# EAGLE board Accumulator Control Unit rev2 (EAGLE 9.6.2)
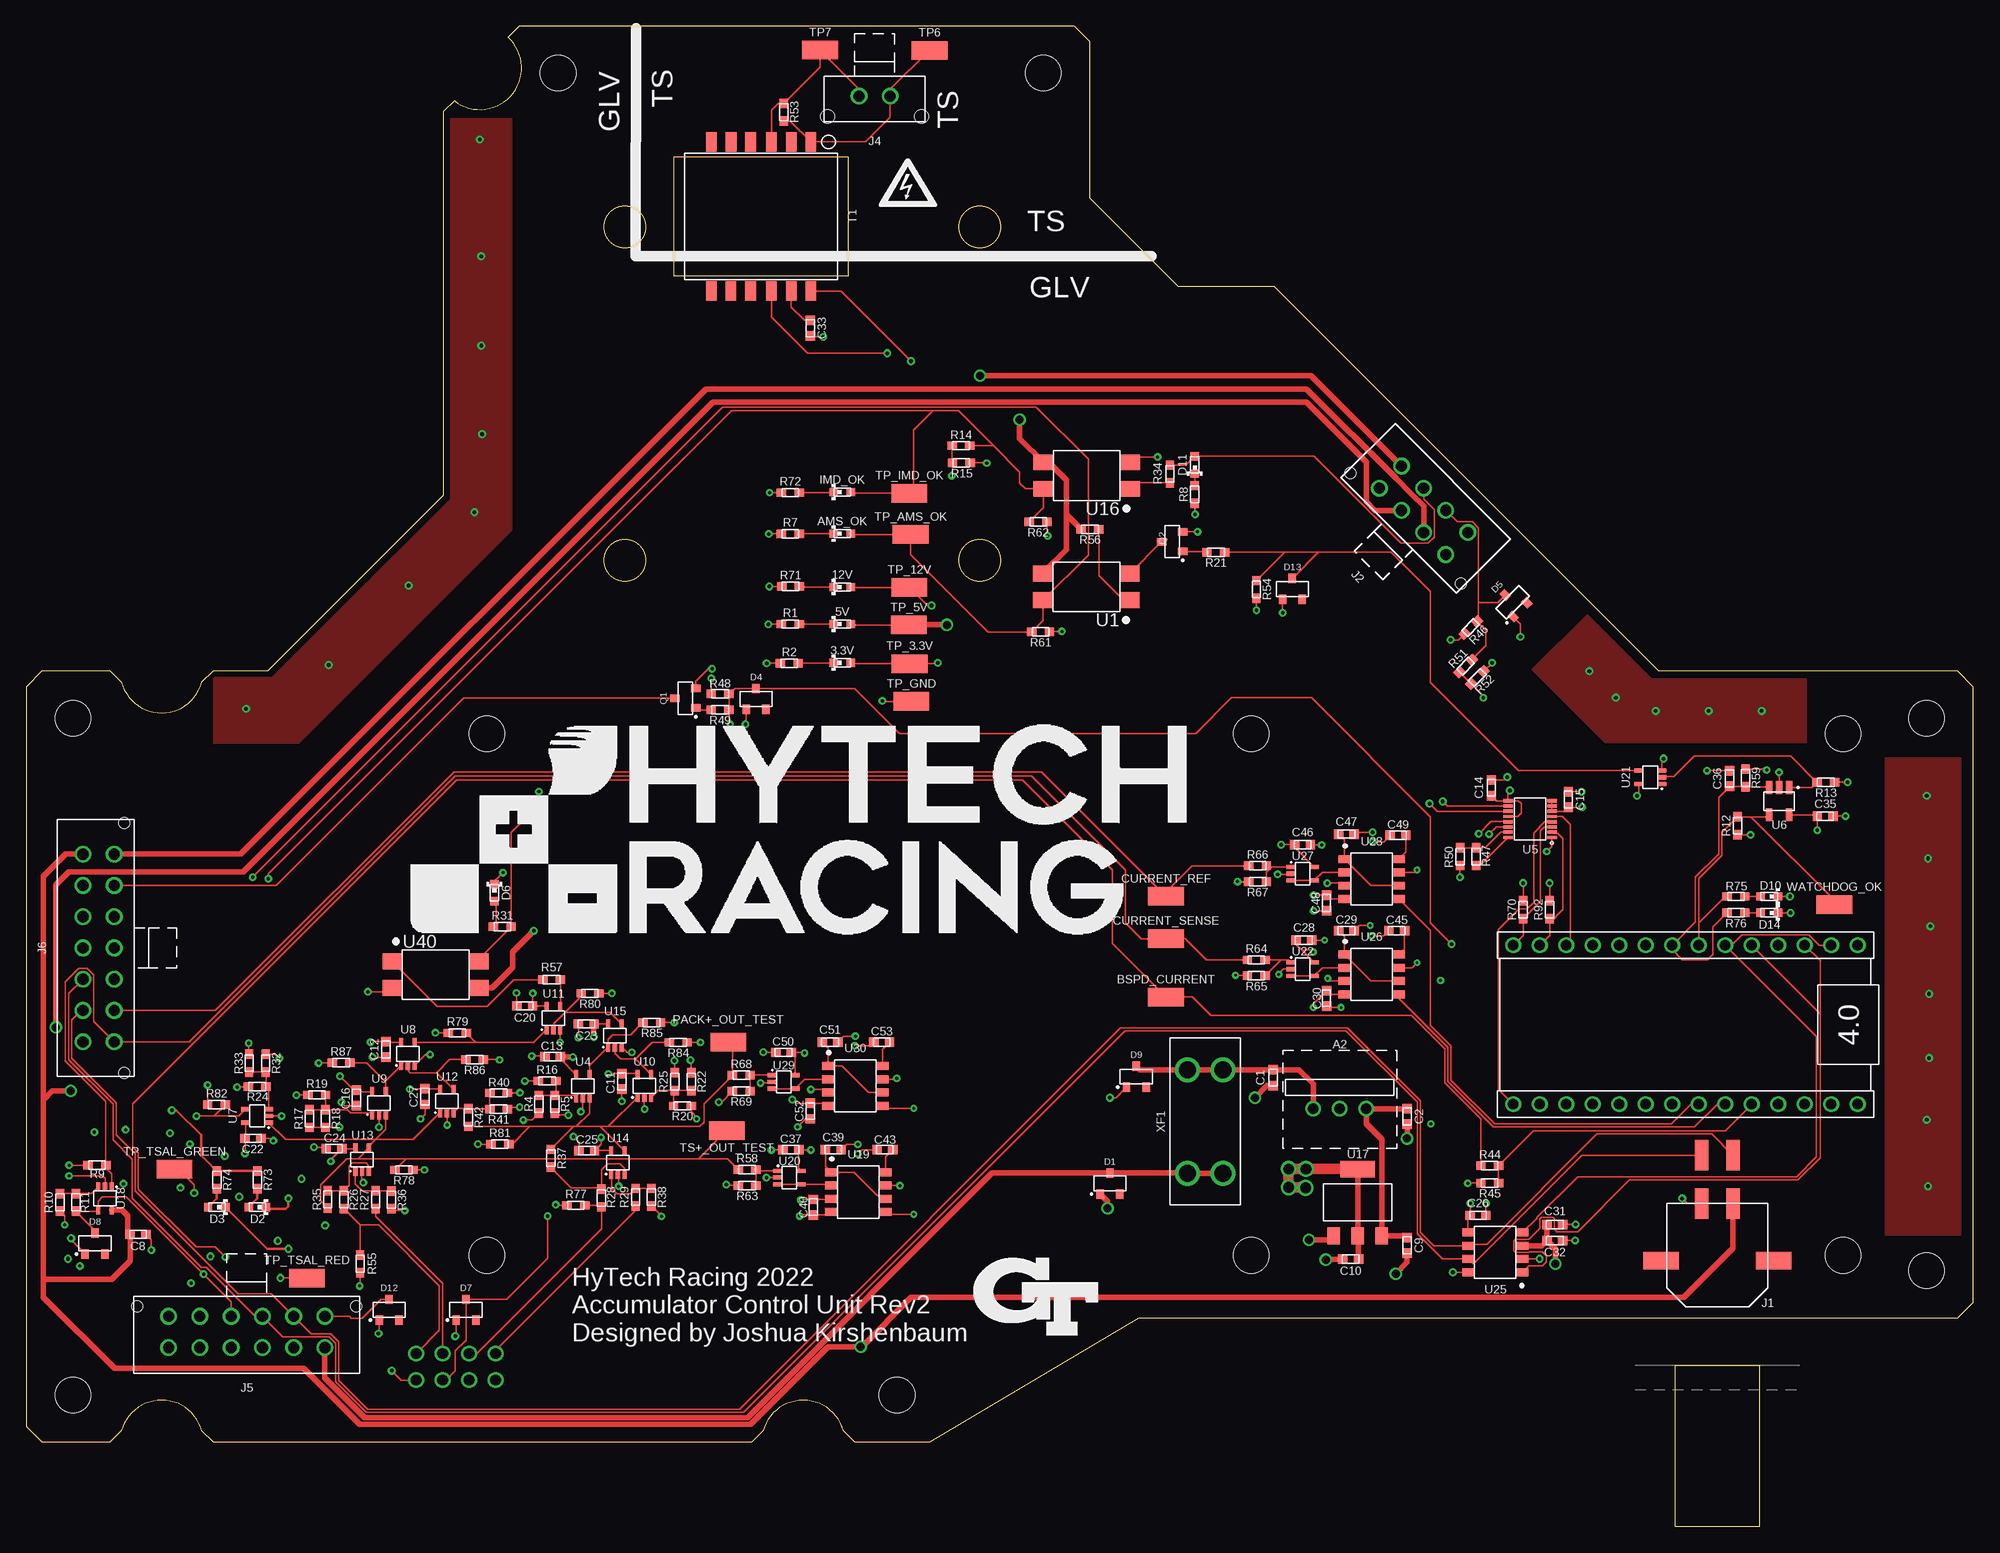
[diagram p6: board, top side]
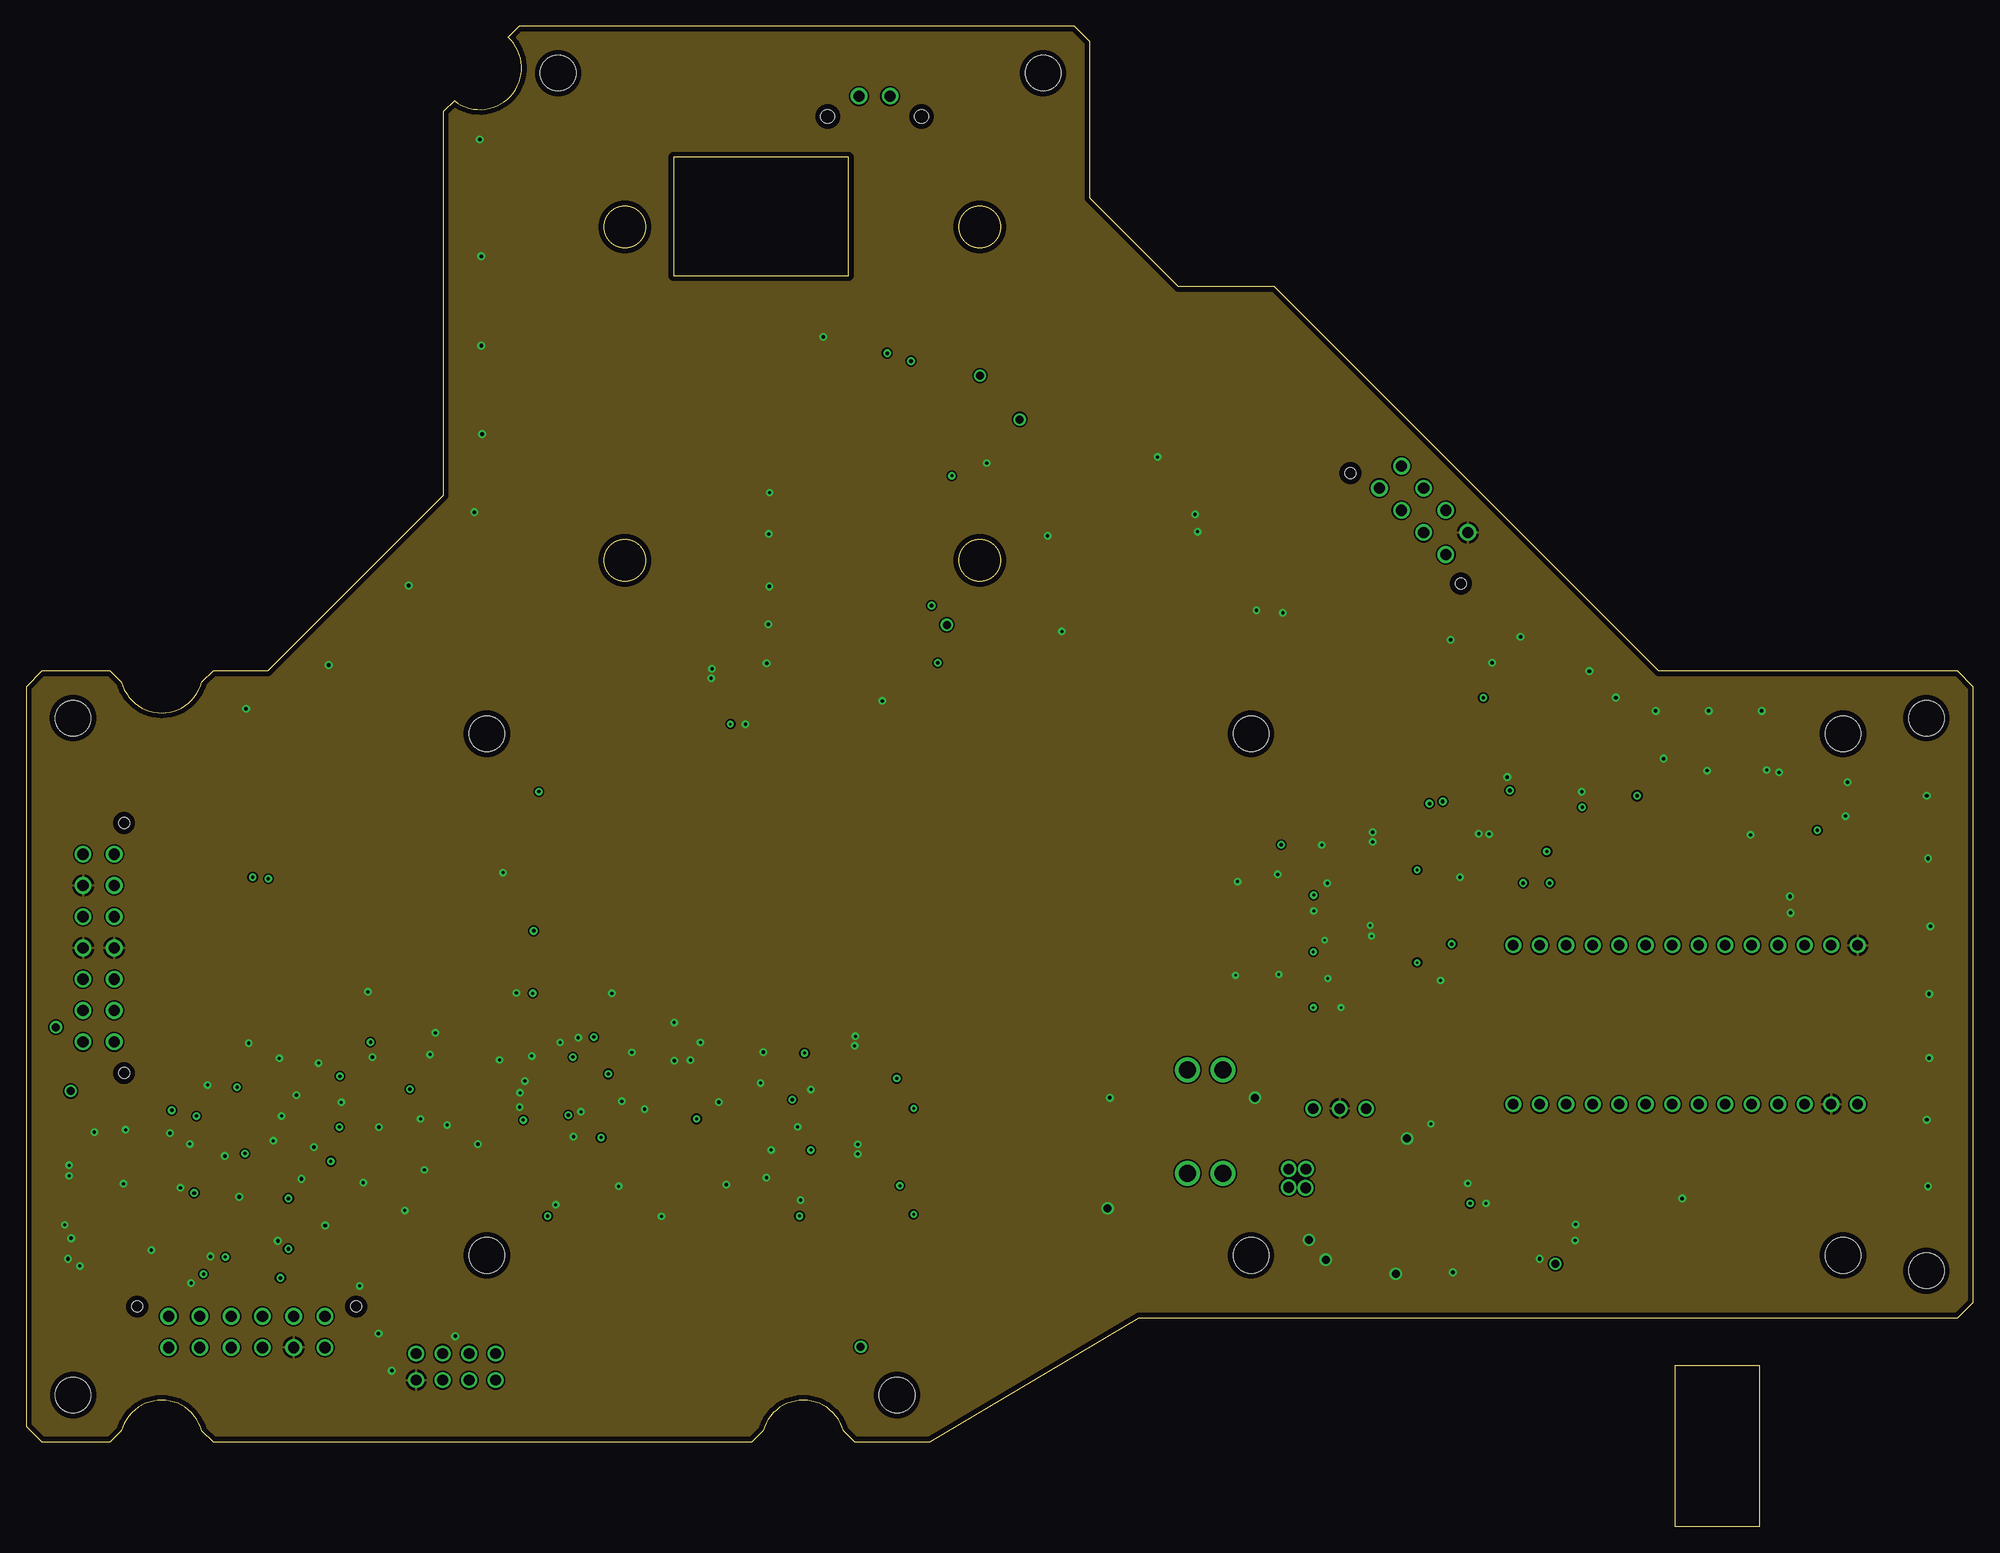
[diagram p7: board, inner layer GND]
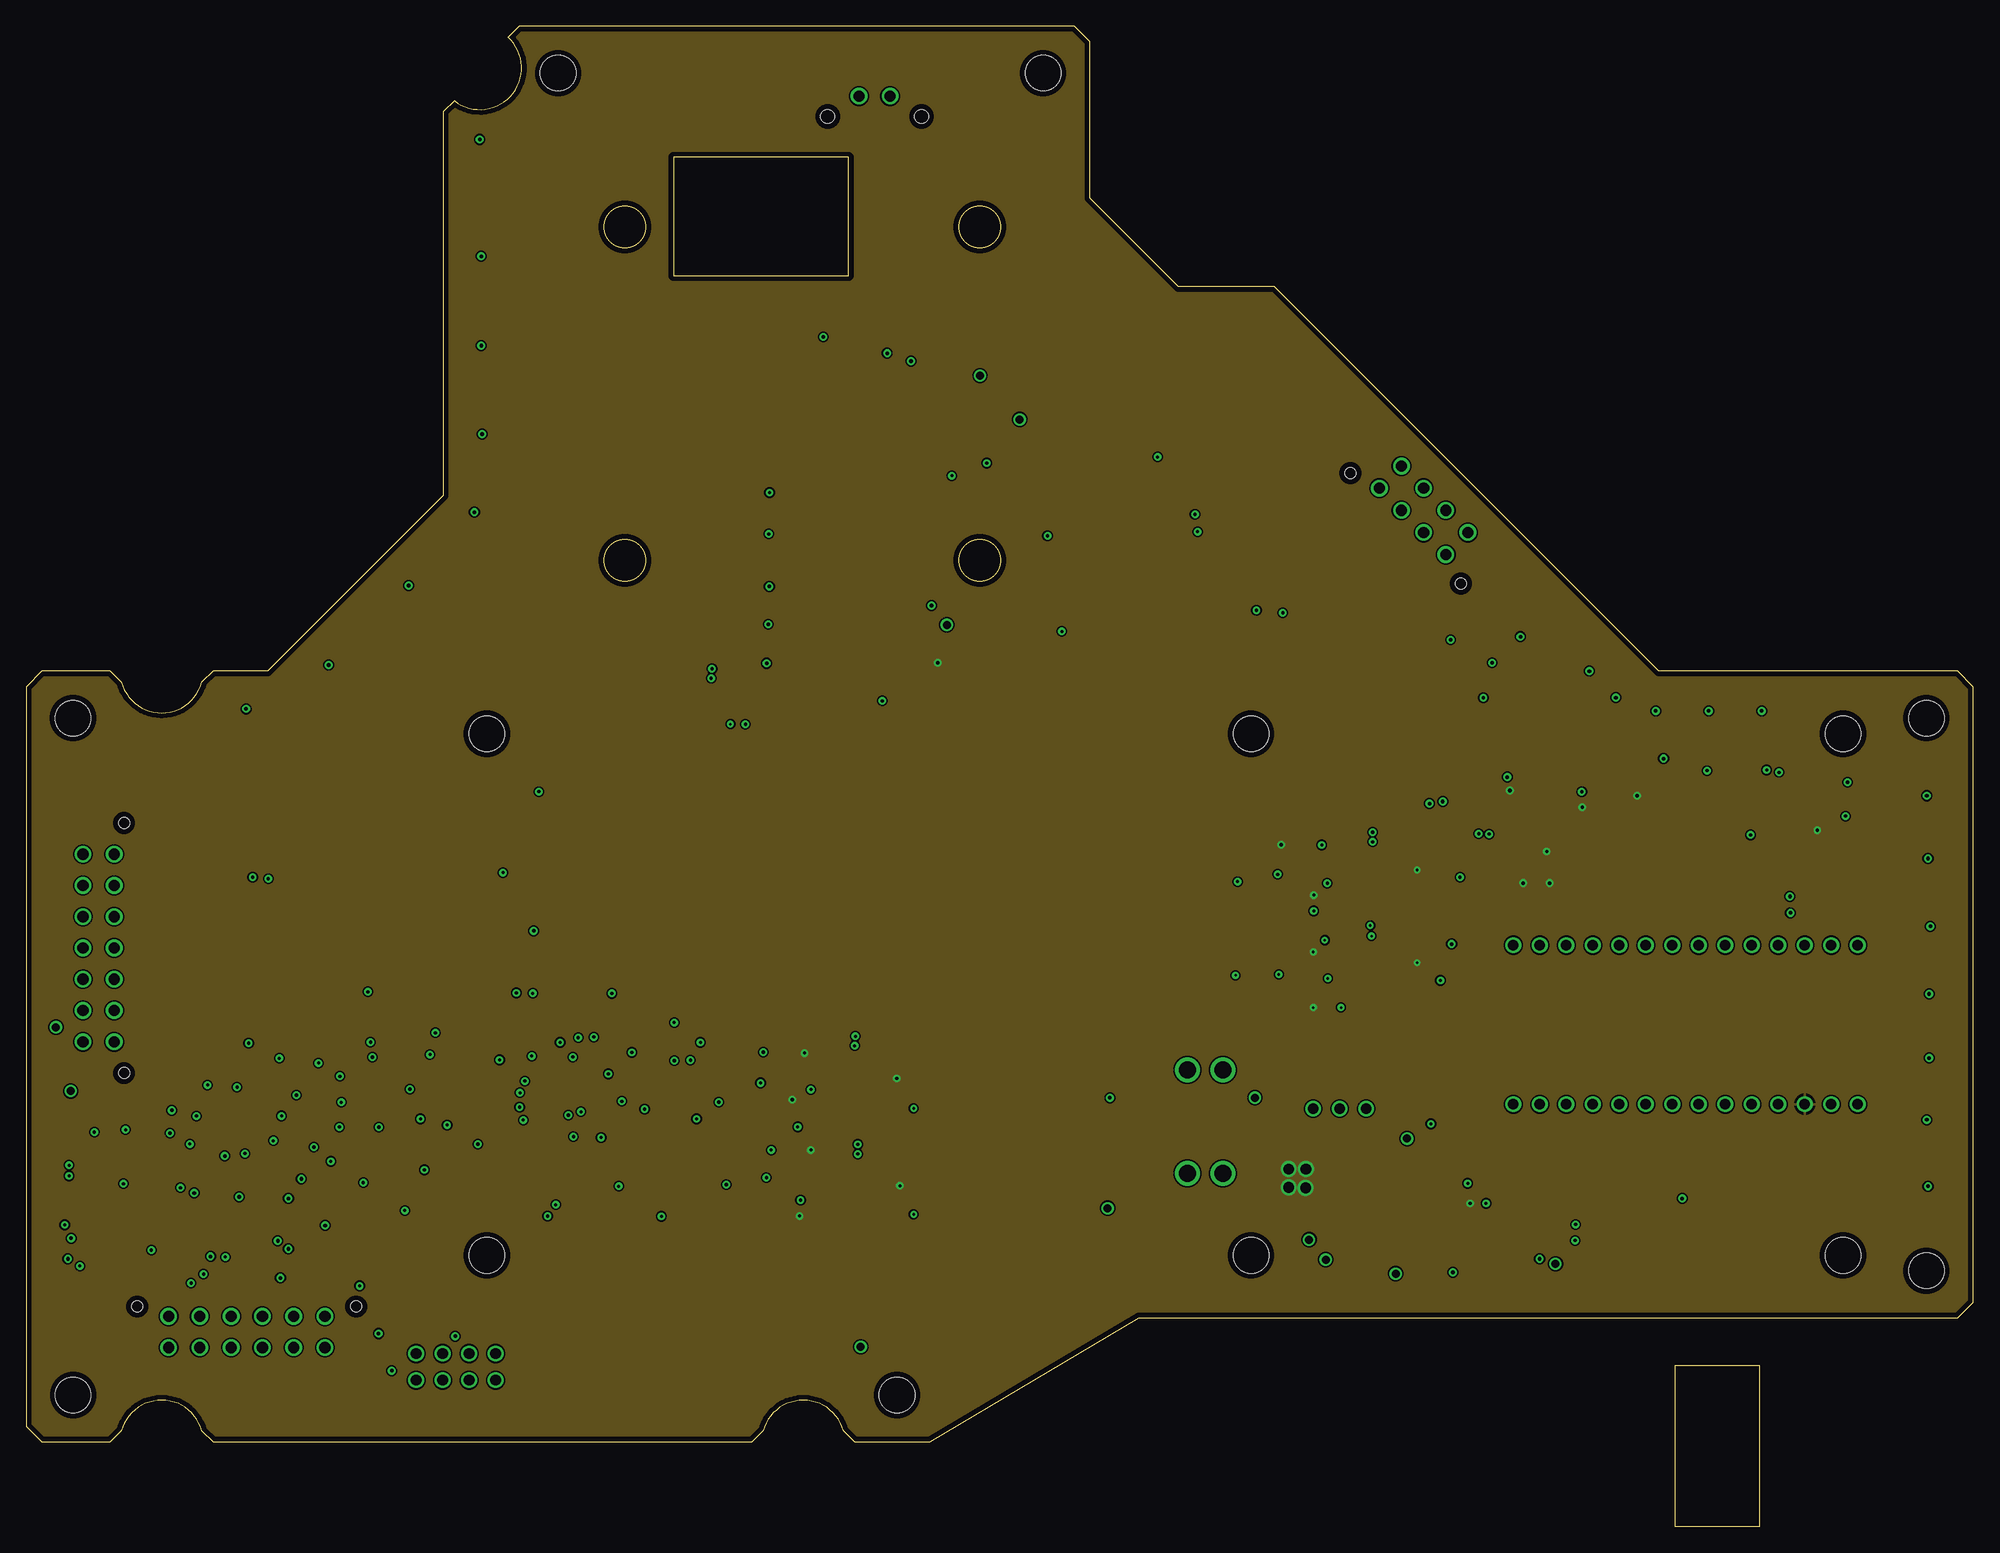
[diagram p8: board, inner layer +3V3]
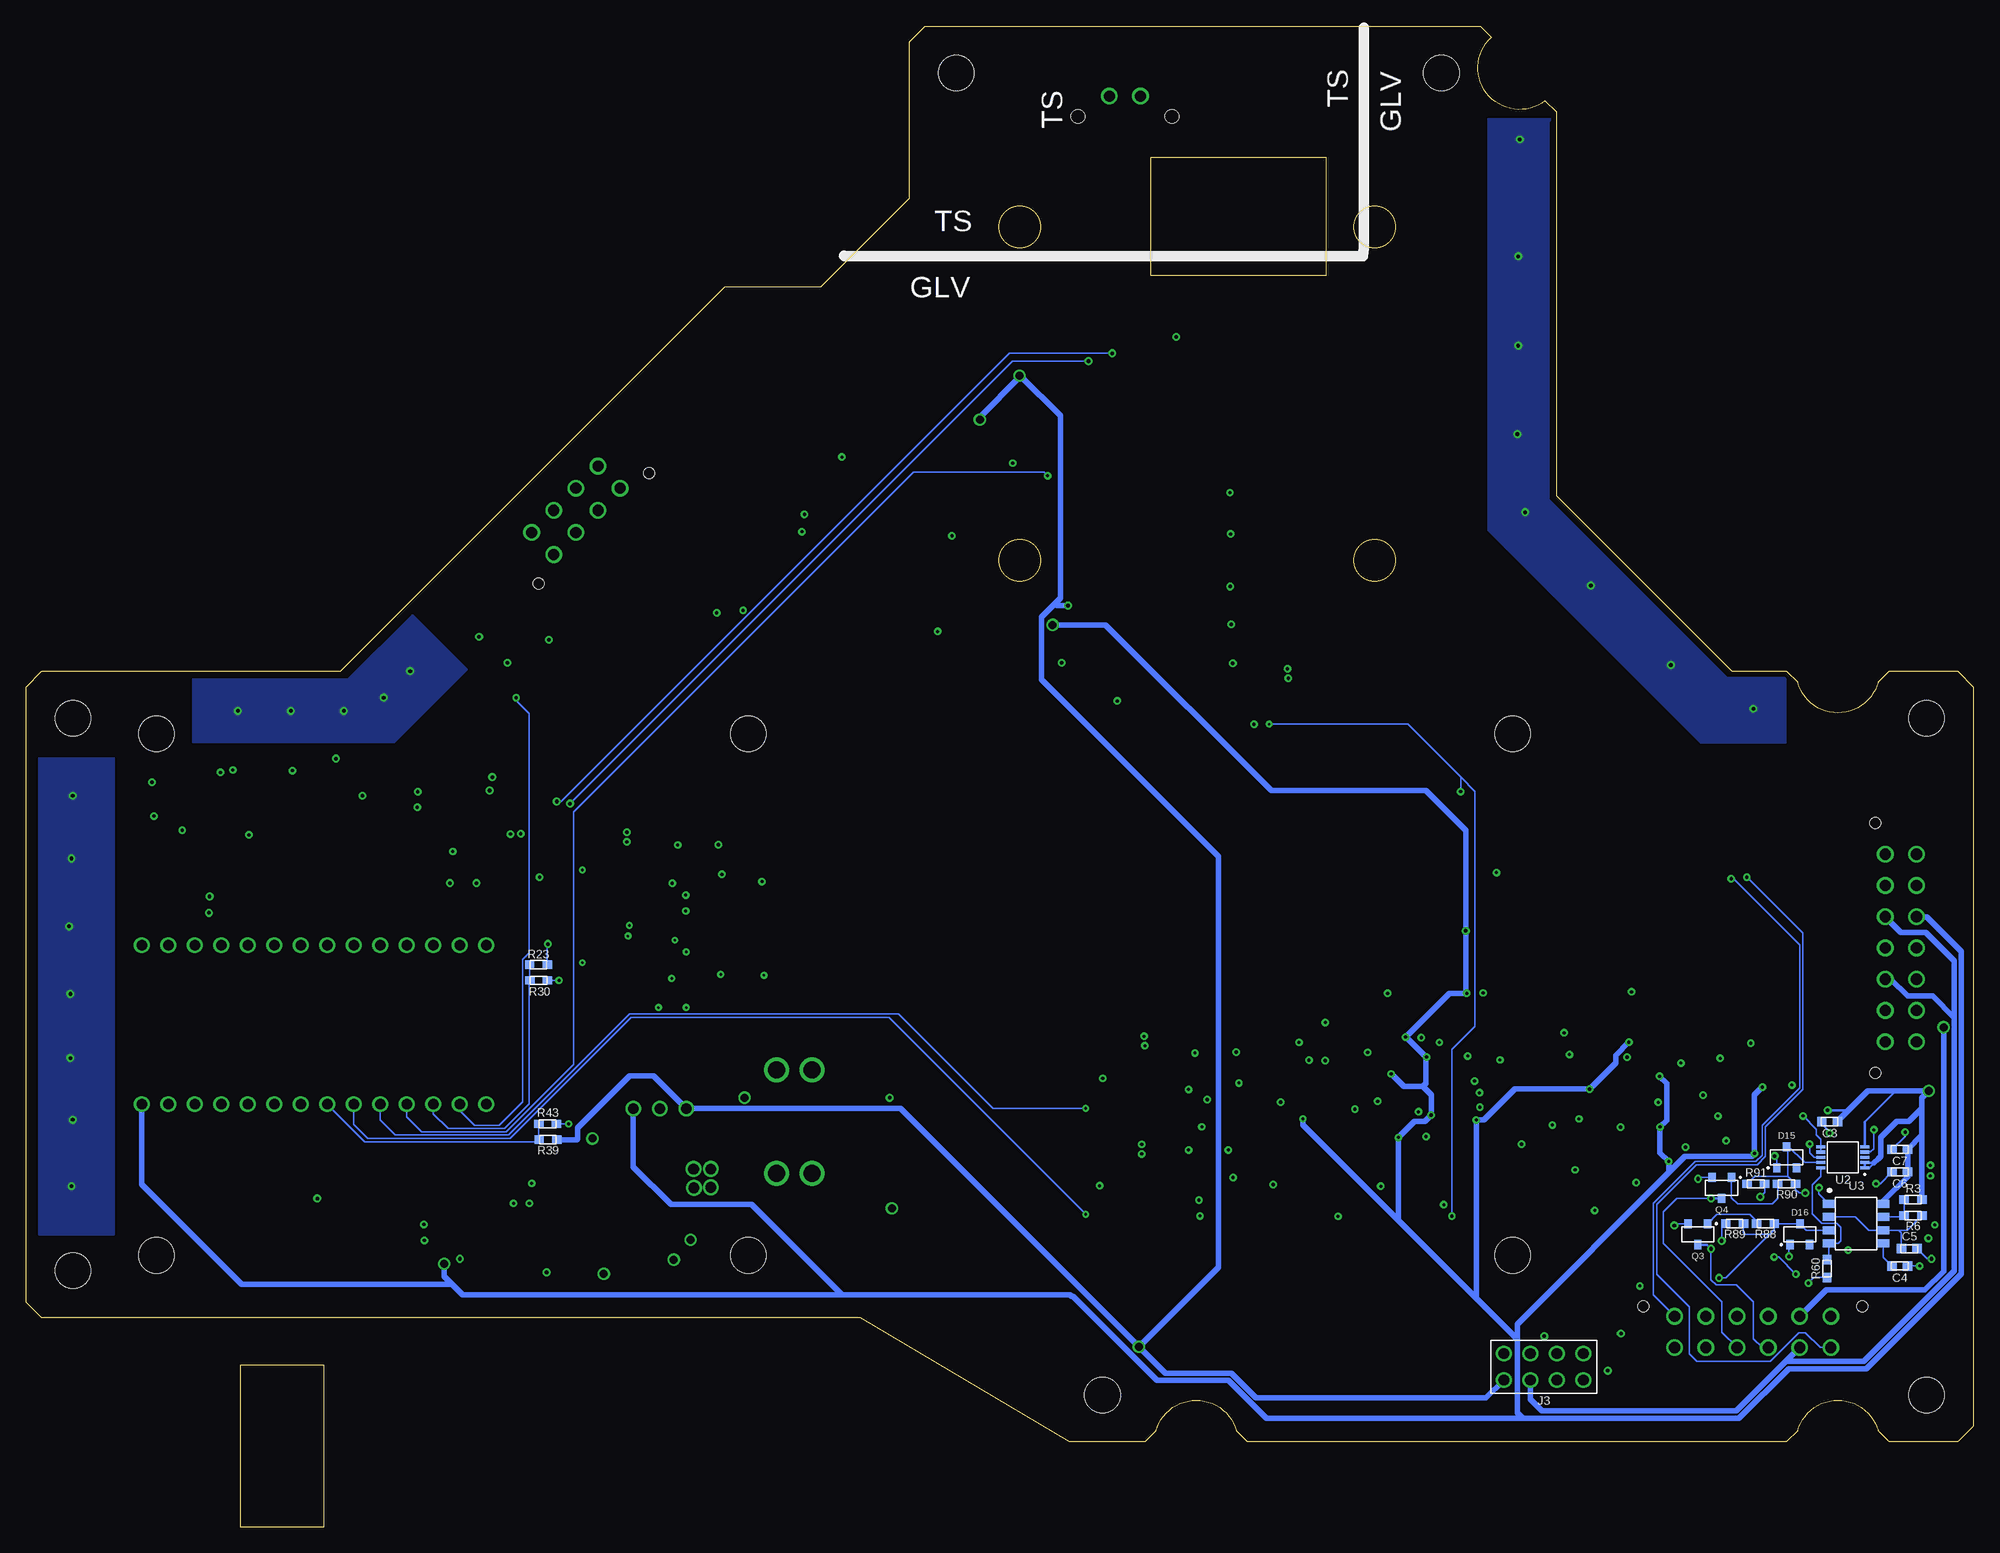
[diagram p9: board, bottom side, seen from below]

Size 186.67 x 135.74 mm. Coordinates in mm from the lower left corner, seen from the top.
Outline: 0,72.39 0,1.5 1.5,0 8.08,0 9.14,1.06 arc-149 16.86,1.06 17.92,0 69.58,0 70.64,1.06 arc-149 78.36,1.06 79.42,0 86.67,0 106.67,11.89 185.17,11.89 186.67,13.39 186.67,72.39 185.17,73.89 156.52,73.89 119.67,110.74 110.48,110.74 102,119.22 102,134.24 100.5,135.74 47.27,135.74 46.21,134.68 arc-175 41.06,128.57 40,127.5 40,90.74 23.15,73.89 17.92,73.89 16.86,72.83 arc-149 9.14,72.83 8.08,73.89 1.5,73.89 0,72.39
Outline: circle at 91.42,116.49 radius 2
Outline: circle at 57.4,84.51 radius 2
Outline: circle at 91.42,84.53 radius 2
Outline: circle at 57.4,116.49 radius 2
Copper layers (1+2*15+16): Top 0.035mm / dielectric 0.2mm / GND 0.0175mm / dielectric 1.065mm / +3V3 0.0175mm / dielectric 0.2mm / Bottom 0.035mm
Design rules "HyTech Default (4 Layer)": minimum track width 6mil, minimum drill 10mil, track to track 6mil, track to pad 6mil, pad to pad 6mil, via to via 20mil, smd to smd 6mil, copper to edge 20mil, drill to drill 21mil, minimum pad ring 8mil, minimum via ring 8mil, stop-mask expansion 3mil, vias tented up to drill 30mil, thermal gap 10mil

## Footprints (pad centres in the part's own frame; a part is rotated, then mirrored left to right if it is on the bottom)
0603-LED = smd 0.8 x 0.8: 1 -0.825,0; 2 0.825,0
TEENSY_SHORT = drill 1.016: 3.3V 0,5.08; AGND/GND 0,2.54; D0 15.24,2.54; D1 15.24,5.08; D2 15.24,7.62; D3 15.24,10.16; D4 15.24,12.7; D5 15.24,15.24; D6 15.24,17.78; D7 15.24,20.32; D8 15.24,22.86; D9 15.24,25.4; D10 15.24,27.94; D11 15.24,30.48; D12 15.24,33.02; D13 0,33.02; D14 0,30.48; D15 0,27.94; D16 0,25.4; D17 0,22.86; D18 0,20.32; D19 0,17.78; D20 0,15.24; D21 0,12.7; D22 0,10.16; D23 0,7.62; GND 15.24,0; VIN 0,0
OKI-78SR = drill 0.991: 1 -2.54,0; 2 0,0; 3 2.54,0
MICRO_MINIATURE = smd 3.429 x 1.778: 1 0,0
0603-CAP = smd 0.9 x 0.9: 1 -0.75,0; 2 0.75,0
SOT-23 = smd 0.711 x 0.889: 1 -0.94,-1.003; 2 0.94,-1.003; 3 0,1.003
MOLEX_MICROFIT_SMD_RIGHTANGLE_04_DUAL = smd 1.27 x 2.921: 1 1.5,5.474; 2 -1.5,5.474; 3 1.5,10.097; 4 -1.5,10.097 | smd 3.429 x 1.651: PAD1 5.386,0; PAD2 -5.386,0
MOLEX_MICROFIT_PTH_VERTICAL_08_DUAL = drill 1.067: 1 4.496,-2.997; 2 1.499,-2.997; 3 -1.499,-2.997; 4 -4.496,-2.997; 5 4.496,0; 6 1.499,0; 7 -1.499,0; 8 -4.496,0 | hole 1.067: 7.493,0.94; -7.493,0.94
FLEX_STACK_PTH_08_DUAL = drill 1.016: 1 -3.81,1.27; 2 -1.27,1.27; 3 1.27,1.27; 4 3.81,1.27; 5 -3.81,-1.27; 6 -1.27,-1.27; 7 1.27,-1.27; 8 3.81,-1.27
MOLEX_MICROFIT_PTH_VERTICAL_02_SINGLE = drill 1.067: 1 1.499,0; 2 -1.499,0 | hole 1.321: 4.496,-1.956; -4.496,-1.956
MOLEX_MICROFIT_PTH_VERTICAL_12_DUAL = drill 1.067: 1 7.493,-2.997; 2 4.496,-2.997; 3 1.499,-2.997; 4 -1.499,-2.997; 5 -4.496,-2.997; 6 -7.493,-2.997; 7 7.493,0; 8 4.496,0; 9 1.499,0; 10 -1.499,0; 11 -4.496,0; 12 -7.493,0 | hole 1.067: 10.49,0.94; -10.49,0.94
MOLEX_MICROFIT_PTH_VERTICAL_14_DUAL = drill 1.067: 1 8.992,-2.997; 2 5.994,-2.997; 3 2.997,-2.997; 4 0,-2.997; 5 -2.997,-2.997; 6 -5.994,-2.997; 7 -8.992,-2.997; 8 8.992,0; 9 5.994,0; 10 2.997,0; 11 0,0; 12 -2.997,0; 13 -5.994,0; 14 -8.992,0 | hole 1.067: 11.989,0.94; -11.989,0.94
0603-RES = smd 0.9 x 0.8: 1 -0.85,0; 2 0.85,0
HM2112ZNLT_AIRGAP = smd 1.02 x 1.89: 1 -4.78,-7.145; 2 -2.89,-7.145; 3 -1,-7.145; 4 1,-7.145; 5 2.875,-7.145; 6 4.78,-7.145; 7 4.78,7.145; 8 2.89,7.145; 9 1,7.145; 10 -1,7.145; 11 -2.89,7.145; 12 -4.78,7.145
DIP-4 = smd 1.5 x 1.9: 1 -1.27,-4.15; 2 1.27,-4.15; 3 -1.27,4.15; 4 1.27,4.15
MSOP-10 = smd 0.305 x 0.889: 1 -1,-2.106; 2 -0.5,-2.106; 3 0,-2.106; 4 0.5,-2.106; 5 1,-2.106; 6 1,2.106; 7 0.5,2.106; 8 0,2.106; 9 -0.5,2.106; 10 -1,2.106
SOIC-08(NARROW,0.15") = smd 0.762 x 1.143: 1 -1.905,-2.603; 2 -0.635,-2.603; 3 0.635,-2.603; 4 1.905,-2.603; 5 1.905,2.603; 6 0.635,2.603; 7 -0.635,2.603; 8 -1.905,2.603
SC-70-5 = smd 0.4 x 0.9: 1 -0.65,-1.1; 2 0,-1.1; 3 0.65,-1.1; 4 0.65,1.1; 5 -0.65,1.1
MSOP-16 = smd 0.305 x 0.889: 1 -1.75,-2.106; 2 -1.25,-2.106; 3 -0.75,-2.106; 4 -0.25,-2.106; 5 0.25,-2.106; 6 0.75,-2.106; 7 1.25,-2.106; 8 1.75,-2.106; 9 1.75,2.106; 10 1.25,2.106; 11 0.75,2.106; 12 0.25,2.106; 13 -0.25,2.106; 14 -0.75,2.106; 15 -1.25,2.106; 16 -1.75,2.106
SOT-23-5 = smd 0.62 x 1.22: 1 -0.95,-1.31; 2 0,-1.31; 3 0.95,-1.31; 4 0.95,1.31; 5 -0.95,1.31
SOT223 = smd 1.2 x 1.6: 1 -2.3,-3.2; 2 0,-3.2; 3 2.3,-3.2 | smd 3.3 x 1.6: 4 0,3.2
MOUNTING_M3 = hole 3.4: 0,0
3568 = drill 1.6: 1 -4.953,1.702; 2 -4.953,-1.702; 3 4.953,-1.702; 4 4.953,1.702

## Placement (x,y rotation side)
3.3V  LED_0603_GREEN  [0603-LED]  78.23,74.69 0 top
5V  LED_0603_BLUE  [0603-LED]  78.23,78.41 0 top
12V  LED_0603_RED  [0603-LED]  78.23,81.96 0 top
A1  TEENSY_4.0  [TEENSY_SHORT]  175.58,32.38 90 top
A2  VOLTAGE_REGULATOR_MODULE_OKI-78SR_5V  [OKI-78SR]  125.93,31.96 0 top
AMS_OK  LED_0603_GREEN  [0603-LED]  78.23,87.08 0 top
BSPD_CURRENT  TEST_POINT  [MICRO_MINIATURE]  109.28,42.64 0 top
C1  CAPACITOR_0603_25V_10UF  [0603-CAP]  119.56,34.93 270 top
C2  CAPACITOR_0603_25V_10UF  [0603-CAP]  132.4,31.2 270 top
C3  CAPACITOR_0603_25V_1UF  [0603-CAP]  13.79,30.72 180 bottom
C4  CAPACITOR_0603_10V_10NF  [0603-CAP]  7.06,16.88 0 bottom
C5  CAPACITOR_0603_10V_4.7UF  [0603-CAP]  6.15,18.52 0 bottom
C6  CAPACITOR_0603_25V_1UF  [0603-CAP]  7.06,25.89 180 bottom
C7  CAPACITOR_0603_25V_0.1UF  [0603-CAP]  7.06,28.05 180 bottom
C8  CAPACITOR_0603_25V_0.1UF  [0603-CAP]  10.72,19.91 0 top
C9  CAPACITOR_0603_10V_1UF  [0603-CAP]  132.38,18.85 270 top
C10  CAPACITOR_0603_10V_4.7UF  [0603-CAP]  126.97,17.53 180 top
C11  CAPACITOR_0603_10V_0.1UF  [0603-CAP]  57.11,34.56 270 top
C12  CAPACITOR_0603_10V_0.1UF  [0603-CAP]  34.5,37.63 270 top
C13  CAPACITOR_0603_10V_0.1UF  [0603-CAP]  50.48,36.92 180 top
C14  CAPACITOR_0603_10V_0.1UF  [0603-CAP]  140.46,62.71 90 top
C15  CAPACITOR_0603_10V_10NF  [0603-CAP]  147.84,61.59 270 top
C16  CAPACITOR_0603_10V_0.1UF  [0603-CAP]  31.68,32.99 270 top
C20  CAPACITOR_0603_10V_0.1UF  [0603-CAP]  47.81,41.8 180 top
C22  CAPACITOR_0603_10V_0.1UF  [0603-CAP]  21.75,29.1 0 top
C23  CAPACITOR_0603_10V_0.1UF  [0603-CAP]  53.7,40.07 180 top
C24  CAPACITOR_0603_10V_0.1UF  [0603-CAP]  29.52,28.11 180 top
C25  CAPACITOR_0603_10V_0.1UF  [0603-CAP]  53.75,27.93 180 top
C26  CAPACITOR_0603_10V_0.1UF  [0603-CAP]  139.19,21.73 180 top
C27  CAPACITOR_0603_10V_0.1UF  [0603-CAP]  38.23,33.11 270 top
C28  CAPACITOR_0603_25V_0.1UF  [0603-CAP]  122.5,48.12 0 top
C29  CAPACITOR_0603_10V_0.1UF  [0603-CAP]  126.56,49.01 0 top
C30  CAPACITOR_0603_10V_0.1UF  [0603-CAP]  124.66,42.53 270 top
C31  CAPACITOR_0603_10V_0.1UF  [0603-CAP]  146.55,20.84 180 top
C32  CAPACITOR_0603_10V_1UF  [0603-CAP]  146.55,19.31 180 top
C33  CAPACITOR_0603_10V_10NF  [0603-CAP]  75.16,106.77 270 top
C35  CAPACITOR_0603_10V_0.1UF  [0603-CAP]  172.46,59.98 0 top
C36  CAPACITOR_0603_10V_0.1UF  [0603-CAP]  163.31,63.6 90 top
C37  CAPACITOR_0603_25V_0.1UF  [0603-CAP]  73.3,28.02 180 top
C39  CAPACITOR_0603_10V_0.1UF  [0603-CAP]  77.37,28.02 0 top
C40  CAPACITOR_0603_10V_0.1UF  [0603-CAP]  75.46,22.51 90 top
C43  CAPACITOR_0603_10V_680PF  [0603-CAP]  82.32,28.02 180 top
C45  CAPACITOR_0603_10V_680PF  [0603-CAP]  131.39,49.01 180 top
C46  CAPACITOR_0603_25V_0.1UF  [0603-CAP]  122.37,57.26 0 top
C47  CAPACITOR_0603_10V_0.1UF  [0603-CAP]  126.56,58.28 0 top
C48  CAPACITOR_0603_10V_0.1UF  [0603-CAP]  124.66,51.67 270 top
C49  CAPACITOR_0603_10V_680PF  [0603-CAP]  131.52,58.15 180 top
C50  CAPACITOR_0603_25V_0.1UF  [0603-CAP]  72.62,37.34 180 top
C51  CAPACITOR_0603_10V_0.1UF  [0603-CAP]  77.06,38.33 0 top
C52  CAPACITOR_0603_10V_0.1UF  [0603-CAP]  75.16,31.73 270 top
C53  CAPACITOR_0603_10V_680PF  [0603-CAP]  82.02,38.33 180 top
CURRENT_REF  TEST_POINT  [MICRO_MINIATURE]  109.28,52.3 0 top
CURRENT_SENSE  TEST_POINT  [MICRO_MINIATURE]  109.28,48.27 0 top
D1  TVS_15V  [SOT-23]  103.91,24.78 0 top
D2  LED_0603_GREEN  [0603-LED]  22.17,22.51 180 top
D3  LED_0603_RED  [0603-LED]  18.29,22.51 180 top
D4  TVS_8V  [SOT-23]  69.97,71.23 0 top
D5  TVS_15V  [SOT-23]  142.49,80.49 45 top
D6  LED_0603_RED  [0603-LED]  44.9,52.65 270 top
D7  TVS_15V  [SOT-23]  42.16,12.68 0 top
D8  TVS_15V  [SOT-23]  6.6,19.03 0 top
D9  TVS_15V  [SOT-23]  106.43,35.03 0 top
D10  LED_0603_GREEN  [0603-LED]  167.11,52.3 180 top
D11  LED_0603_YELLOW  [0603-LED]  112.04,93.66 90 top
D12  TVS_15V  [SOT-23]  34.8,12.68 0 top
D13  TVS_8V  [SOT-23]  121.39,81.78 0 top
D14  LED_0603_RED  [0603-LED]  167.11,50.73 180 top
D15  TVS_15V  [SOT-23]  17.91,27.28 0 bottom
D16  TVS_15V  [SOT-23]  16.64,19.91 0 bottom
IMD_OK  LED_0603_ORANGE  [0603-LED]  78.23,91.06 0 top
J1  CONNECTOR-CAN_μF_S_RA_  [MOLEX_MICROFIT_SMD_RIGHTANGLE_04_DUAL]  162.12,17.38 0 top
J2  CONNECTOR-8_MF_T_V_  [MOLEX_MICROFIT_PTH_VERTICAL_08_DUAL]  132.91,88.25 135 top
J3  CONNECTOR-8_S_S  [FLEX_STACK_PTH_08_DUAL]  41.2,7.2 0 bottom
J4  CONNECTOR-2_MF_T_V_  [MOLEX_MICROFIT_PTH_VERTICAL_02_SINGLE]  81.34,129.02 0 top
J5  CONNECTOR-12_MF_T_V_  [MOLEX_MICROFIT_PTH_VERTICAL_12_DUAL]  21.15,12.05 0 top
J6  CONNECTOR-14_MF_T_V_  [MOLEX_MICROFIT_PTH_VERTICAL_14_DUAL]  8.45,47.36 270 top
PACK+_OUT_TEST  TEST_POINT  [MICRO_MINIATURE]  67.31,38.33 180 top
Q1  TRANSISTOR_N_MOS__PMV15ENEA  [SOT-23]  63.19,71.31 90 top
Q2  TRANSISTOR_N_MOS__PMV15ENEA  [SOT-23]  109.86,86.31 90 top
Q3  TRANSISTOR_N_MOS__PMV15ENEA  [SOT-23]  26.42,19.91 180 bottom
Q4  TRANSISTOR_N_MOS__PMV15ENEA  [SOT-23]  24.13,24.36 180 bottom
R1  RESISTOR_0603_1K  [0603-RES]  73.25,78.41 0 top
R2  RESISTOR_0603_1K  [0603-RES]  73.15,74.65 0 top
R3  RESISTOR_0603_1K  [0603-RES]  5.79,23.23 0 bottom
R4  RESISTOR_0603_DNP  [0603-RES]  49.15,32.38 270 top
R5  RESISTOR_0603_4.12K  [0603-RES]  50.68,32.38 270 top
R6  RESISTOR_0603_43K  [0603-RES]  5.79,21.7 180 bottom
R7  RESISTOR_0603_1K  [0603-RES]  73.25,87.07 0 top
R8  RESISTOR_0603_1K  [0603-RES]  112.04,90.83 90 top
R9  RESISTOR_0603_10K  [0603-RES]  6.8,26.53 0 top
R10  RESISTOR_0603_1K  [0603-RES]  3.25,22.97 90 top
R11  RESISTOR_0603_1.4K  [0603-RES]  4.77,22.97 270 top
R12  RESISTOR_0603_10K  [0603-RES]  164.05,59.08 90 top
R13  RESISTOR_0603_100K  [0603-RES]  172.52,63.24 180 top
R14  RESISTOR_0603_33K  [0603-RES]  89.62,95.51 180 top
R15  RESISTOR_0603_12K  [0603-RES]  89.65,93.88 0 top
R16  RESISTOR_0603_10.2K  [0603-RES]  49.94,34.61 0 top
R17  RESISTOR_0603_4.12K  [0603-RES]  27.16,31.01 270 top
R18  RESISTOR_0603_DNP  [0603-RES]  28.71,31.01 270 top
R19  RESISTOR_0603_10.2K  [0603-RES]  27.87,33.27 0 top
R20  RESISTOR_0603_11.5K  [0603-RES]  62.92,32.22 0 top
R21  RESISTOR_0603_10  [0603-RES]  114.05,85.3 180 top
R22  RESISTOR_0603_DNP  [0603-RES]  63.76,34.54 270 top
R23  RESISTOR_0603_18.7K  [0603-RES]  137.56,45.76 180 bottom
R24  RESISTOR_0603_84.5K  [0603-RES]  22.15,34.05 180 top
R25  RESISTOR_0603_11.5K  [0603-RES]  62.19,34.54 270 top
R26  RESISTOR_0603_11.5K  [0603-RES]  30.46,23.23 90 top
R27  RESISTOR_0603_11.5K  [0603-RES]  33.51,23.23 90 top
R28  RESISTOR_0603_11.5K  [0603-RES]  55.15,23.39 90 top
R29  RESISTOR_0603_11.5K  [0603-RES]  58.43,23.46 90 top
R30  RESISTOR_0603_33K  [0603-RES]  137.54,44.24 0 bottom
R31  RESISTOR_0603_1K  [0603-RES]  45.65,49.39 0 top
R32  RESISTOR_0603_DNP  [0603-RES]  22.97,36.31 270 top
R33  RESISTOR_0603_11.5K  [0603-RES]  21.39,36.31 270 top
R34  RESISTOR_0603_2K  [0603-RES]  109.65,92.8 270 top
R35  RESISTOR_0603_10.5K  [0603-RES]  28.91,23.26 270 top
R36  RESISTOR_0603_10.5K  [0603-RES]  35.03,23.21 270 top
R37  RESISTOR_0603_10.5K  [0603-RES]  50.3,27.2 90 top
R38  RESISTOR_0603_10.5K  [0603-RES]  59.95,23.46 270 top
R39  RESISTOR_0603_33K  [0603-RES]  136.65,28.97 180 bottom
R40  RESISTOR_0603_DNP  [0603-RES]  45.29,33.47 180 top
R41  RESISTOR_0603_215K  [0603-RES]  45.29,31.92 180 top
R42  RESISTOR_0603_11.3K  [0603-RES]  42.4,31.11 270 top
R43  RESISTOR_0603_12K  [0603-RES]  136.67,30.49 0 bottom
R44  RESISTOR_0603_33K  [0603-RES]  140.3,26.48 0 top
R45  RESISTOR_0603_12K  [0603-RES]  140.3,24.83 180 top
R46  RESISTOR_0603_2.2K  [0603-RES]  138.48,78.07 45 top
R47  RESISTOR_0603_1K  [0603-RES]  139.02,56.12 90 top
R48  RESISTOR_0603_10K  [0603-RES]  66.52,71.74 180 top
R49  RESISTOR_0603_10  [0603-RES]  66.52,70.19 180 top
R50  RESISTOR_0603_1K  [0603-RES]  137.47,56.11 270 top
R51  RESISTOR_0603_33K  [0603-RES]  138,74.39 225 top
R52  RESISTOR_0603_15K  [0603-RES]  139.12,73.29 45 top
R53  RESISTOR_0603_100  [0603-RES]  72.64,127.48 270 top
R54  RESISTOR_0603_10K  [0603-RES]  117.95,81.73 270 top
R55  RESISTOR_0603_10K  [0603-RES]  32.03,17.07 90 top
R56  RESISTOR_0603_2K  [0603-RES]  101.99,87.51 180 top
R57  RESISTOR_0603_470  [0603-RES]  50.37,44.31 180 top
R58  RESISTOR_0603_10K  [0603-RES]  69.11,26.11 0 top
R59  RESISTOR_0603_10K  [0603-RES]  164.83,63.66 270 top
R60  RESISTOR_0603_10K  [0603-RES]  14.04,16.62 90 bottom
R61  RESISTOR_0603_10K  [0603-RES]  97.26,77.66 180 top
R62  RESISTOR_0603_10K  [0603-RES]  97.01,88.2 180 top
R63  RESISTOR_0603_12K  [0603-RES]  69.11,24.59 180 top
R64  RESISTOR_0603_10K  [0603-RES]  117.93,46.21 0 top
R65  RESISTOR_0603_12K  [0603-RES]  117.93,44.69 180 top
R66  RESISTOR_0603_10K  [0603-RES]  118.05,55.23 0 top
R67  RESISTOR_0603_12K  [0603-RES]  118.05,53.71 180 top
R68  RESISTOR_0603_10K  [0603-RES]  68.55,35.16 0 top
R69  RESISTOR_0603_12K  [0603-RES]  68.55,33.63 180 top
R70  RESISTOR_0603_2K  [0603-RES]  143.51,51.03 90 top
R71  RESISTOR_0603_1K  [0603-RES]  73.28,82.02 0 top
R72  RESISTOR_0603_2K  [0603-RES]  73.25,91.01 0 top
R73  RESISTOR_0603_2K  [0603-RES]  22.17,25.12 270 top
R74  RESISTOR_0603_2K  [0603-RES]  18.29,25.12 270 top
R75  RESISTOR_0603_470  [0603-RES]  163.91,52.3 180 top
R76  RESISTOR_0603_470  [0603-RES]  163.91,50.73 180 top
R77  RESISTOR_0603_10K  [0603-RES]  52.7,22.68 0 top
R78  RESISTOR_0603_10K  [0603-RES]  36.22,26.09 180 top
R79  RESISTOR_0603_10K  [0603-RES]  41.35,39.22 0 top
R80  RESISTOR_0603_10K  [0603-RES]  54.05,43 180 top
R81  RESISTOR_0603_10K  [0603-RES]  45.42,28.55 0 top
R82  RESISTOR_0603_10K  [0603-RES]  18.26,32.34 0 top
R84  RESISTOR_0603_10K  [0603-RES]  62.51,38.3 180 top
R85  RESISTOR_0603_10K  [0603-RES]  59.97,40.21 180 top
R86  RESISTOR_0603_10K  [0603-RES]  43,36.65 180 top
R87  RESISTOR_0603_10K  [0603-RES]  30.2,36.35 0 top
R88  RESISTOR_0603_10  [0603-RES]  19.94,20.93 180 bottom
R89  RESISTOR_0603_10K  [0603-RES]  22.89,20.93 180 bottom
R90  RESISTOR_0603_10  [0603-RES]  17.91,24.74 180 bottom
R91  RESISTOR_0603_10K  [0603-RES]  20.85,24.74 0 bottom
R92  RESISTOR_0603_2K  [0603-RES]  146.05,51.03 90 top
T1  TRANSFORMER_HM2112ZNLT_AIRGAP  [HM2112ZNLT_AIRGAP]  70.45,117.49 180 top
TP6  TEST_POINT  [MICRO_MINIATURE]  86.59,133.42 0 top
TP7  TEST_POINT  [MICRO_MINIATURE]  76.1,133.44 0 top
TP_3.3V  TEST_POINT  [MICRO_MINIATURE]  84.68,74.62 0 top
TP_5V  TEST_POINT  [MICRO_MINIATURE]  84.62,78.32 0 top
TP_12V  TEST_POINT  [MICRO_MINIATURE]  84.66,81.93 0 top
TP_AMS_OK  TEST_POINT  [MICRO_MINIATURE]  84.79,87 0 top
TP_GND  TEST_POINT  [MICRO_MINIATURE]  84.85,71 0 top
TP_IMD_OK  TEST_POINT  [MICRO_MINIATURE]  84.66,90.96 0 top
TP_TSAL_GREEN  TEST_POINT  [MICRO_MINIATURE]  14.22,26.14 0 top
TP_TSAL_RED  TEST_POINT  [MICRO_MINIATURE]  26.92,15.72 0 top
TS+_OUT_TEST  TEST_POINT  [MICRO_MINIATURE]  67.16,29.85 180 top
U1  RELAY_SOLIDSTATE_NO  [DIP-4]  101.64,81.98 90 top
U2  ADG1423  [MSOP-10]  12.52,27.29 90 bottom
U3  LM555  [SOIC-08(NARROW,0.15")]  11.25,20.94 270 bottom
U4  OPAMP_1_CHANNEL_OPA991  [SC-70-5]  53.37,34.1 0 top
U5  LTC6820  [MSOP-16]  144.17,59.71 90 top
U6  ADM8316WBX30  [SOT-23-5]  168.05,61.43 180 top
U7  OPAMP_1_CHANNEL_OPA991  [SC-70-5]  22.15,31.26 90 top
U8  LOGICGATE_AND_DCK3  [SC-70-5]  36.61,37.2 0 top
U9  OPAMP_1_CHANNEL_OPA991  [SC-70-5]  33.84,32.48 0 top
U10  OPAMP_1_CHANNEL_OPA991  [SC-70-5]  59.26,34.13 0 top
U11  LOGICGATE_AND_DCK3  [SC-70-5]  50.55,40.63 0 top
U12  OPAMP_1_CHANNEL_OPA991  [SC-70-5]  40.34,32.68 0 top
U13  OPAMP_1_CHANNEL_OPA991  [SC-70-5]  32.21,27.07 0 top
U14  OPAMP_1_CHANNEL_OPA991  [SC-70-5]  56.72,26.79 0 top
U15  LOGICGATE_AND_DCK3  [SC-70-5]  56.44,38.96 0 top
U16  RELAY_SOLIDSTATE_NO  [DIP-4]  101.67,92.64 90 top
U17  VOLTAGE_REGULATOR_SOT223_3.3V  [SOT223]  127.66,22.96 0 top
U18  OPAMP_1_CHANNEL_OPA991  [SC-70-5]  7.56,23.35 180 top
U19  MAX7404  [SOIC-08(NARROW,0.15")]  79.78,23.95 270 top
U20  OPAMP_1_CHANNEL_OPA991  [SC-70-5]  73.18,25.35 270 top
U21  LOGICGATE_BUFFER  [SC-70-5]  155.7,63.73 90 top
U22  OPAMP_1_CHANNEL_OPA991  [SC-70-5]  122.37,45.32 270 top
U25  TCAN1051HQV-Q1  [SOIC-08(NARROW,0.15")]  140.84,18.17 90 top
U26  MAX7404  [SOIC-08(NARROW,0.15")]  128.98,44.82 270 top
U27  OPAMP_1_CHANNEL_OPA991  [SC-70-5]  122.37,54.47 270 top
U28  MAX7404  [SOIC-08(NARROW,0.15")]  128.98,53.96 270 top
U29  OPAMP_1_CHANNEL_OPA991  [SC-70-5]  72.62,34.52 270 top
U30  MAX7404  [SOIC-08(NARROW,0.15")]  79.48,34.14 270 top
U40  RELAY_SOLIDSTATE_NO  [DIP-4]  39.26,44.8 270 top
U$1  [GLV]  99.06,110.72 0 top
U$3  [TS]  88.34,127.74 90 top
U$4  [HV_0.50"]  84.53,120.73 0 top
U$5  [GLV]  55.88,128.5 90 top
U$6  [MOUNTING_M3]  83.49,4.5 0 top
U$7  [MOUNTING_M3]  4.5,4.5 0 top
U$8  [MOUNTING_M3]  182.17,16.41 0 top
U$9  [TS]  60.96,129.77 90 top
U$10  [TS]  97.79,117.07 180 top
U$11  [MOUNTING_M3]  174.17,17.89 0 top
U$12  [MOUNTING_M3]  117.42,17.89 0 top
U$13  [MOUNTING_M3]  44.17,17.89 0 top
U$14  [MOUNTING_M3]  182.17,69.39 0 top
U$15  [LOGO_HYTECH_EXTRA_LARGE]  36.73,48.54 0 top
U$16  [LOGO_GT_0.50"]  96.77,13.95 0 top
U$17  [MOUNTING_M3]  174.17,67.89 0 top
U$18  [MOUNTING_M3]  117.42,67.89 0 top
U$19  [MOUNTING_M3]  44.17,67.89 0 top
U$20  [MOUNTING_M3]  4.5,69.39 0 top
U$21  [MOUNTING_M3]  51,131.24 0 top
U$22  [MOUNTING_M3]  97.5,131.24 0 top
WATCHDOG_OK  TEST_POINT  [MICRO_MINIATURE]  173.33,51.51 0 top
XF1  FUSE_HOLDER_MINIBLADEPTH  [3568]  113.03,30.71 90 top

## Tracks (layer width: path | path; a pad name or v marks a point on that pad's centre or on a via)
0.95X_DIV
  Top 0.152: R40.2 R41.2 42.44,31.92 R42.1 41.37,31.96 U12.3
0.5989V_DIV
  Top 0.152: U7.3 23.25,33.8 R24.1 23,35.43 R32.2 R33.2
2.5_DIV
  Top 0.152: R22.2 R25.2 | U10.3 60.57,33.69 R25.2 | R20.1 62.07,33.57 R25.2
3.56V_DIV_A
  Top 0.152: R18.1 28.71,33.25 R19.2 | R17.1 R18.1 | R18.1 30.84,31.86 31.14,31.56 33.01,31.56 U9.1
3.56V_DIV_B
  Top 0.152: R5.1 R4.1 | R16.2 50.79,33.34 R5.1 | R5.1 52.5,33.23 U4.1
12V_SCALED_3.3V
  Bottom 0.152: R43.1 137.52,28.99 R39.2 137.68,28.78 154.2,28.78 A1.D19
12VIN
  Top 0.508: J5.1 28.64,6.13 32.44,2.34 69.17,2.34 92.61,25.78 D1.3 111.31,25.78 XF1.1 XF1.2
60V_THRESHOLD  (via drill 0.3)
  Top 0.152: v16.33,31.25 18.03,31.25 | 18.03,31.25 20.4,31.25 U7.4 | R82.2 18.03,31.25
  Bottom 0.152: U2.7 U2.6 14.62,29.01 15.06,29.44 15.06,29.98 v16.33,31.25
+3V3  (via drill 0.25, 0.3, 0.35, 1.02)
  Top 0.152: U26.4 125.03,42.91 C30.1 123.39,42.01 v123.39,41.64 | U22.5 122.29,47.15 | 122.29,47.15 121.75,47.7 C28.1 | 122.29,47.15 123.21,47.15 v123.39,46.98 | U25.5 138.23,21.52 C26.2 138.44,22.86 v138.42,22.87 | U20.5 74.05,26.22 C37.1 75.21,28.02 v75.23,27.99 | U19.4 76.89,21.76 C40.1 74.23,21.76 v74.14,21.67 | U19.7 83.74,24.59 v83.77,24.56 | U29.5 73.72,36.99 C50.1 74.57,37.34 v74.62,37.29 | U30.4 76.63,32.48 C52.1 73.8,32.48 v73.46,32.82 | U30.7 83.39,34.77 v83.46,34.85 | U28.4 125.03,52.06 C48.1 v123.45,52.42 v123.44,52.43 | U27.5 121.62,56.97 C46.1 120.33,57.26 v120.32,57.25 | v149.17,60.85 v149.16,60.84 C15.2 147.46,60.46 U5.6 U5.7 U5.8 | v87.4,74.7 87.32,74.62 TP_3.3V.1 79.13,74.62 3.3V.2 | U28.7 133.11,54.6 v133.35,54.84 | U26.7 132.85,45.45 v133.35,45.95 | R92.2 v146.05,53.57 | R70.2 v143.51,53.57 | U5.1 146.28,57.11 v145.78,56.61 | U5.9 143.06,61.46 143.33,61.19 143.33,60.28 143.02,59.96 U5.12 | U5.9 142.06,62.28 v142.24,62.46 | C14.1 140.96,61.46 U5.9 | U21.5 154.6,62.12 v154.43,61.95 | U6.5 171.57,60.12 C35.1 v171.71,58.66 v171.7,58.65
  Top 0.508: C10.1 127.72,19.7 U17.2 U17.4
  Top 1.016: U17.4 v122.68,26.16 | v122.68,26.16 | v122.68,26.16 v121.03,26.16 v121.03,24.41 122.61,24.41 v122.66,24.36
  pour +3V3: -24.13,151.36 -24.13,-6.12 196.85,-6.12 196.85,151.36
+5V  (via drill 0.3, 0.35, 0.76)
  Top 0.152: U4.5 51.23,36.7 C13.1 | R4.2 48.49,30.87 v47.66,30.87 | R5.2 50.87,31.34 v51.97,31.34 | U10.5 58.53,35.31 C11.1 55.83,35.31 v55.81,35.29 | R20.2 63.77,31.62 64.27,31.12 v64.27,30.97 | U7.5 21.05,29.16 C22.1 21,27.68 v20.97,27.66 | v20.23,34.02 20.27,34.05 R24.2 | v30.09,35.06 31.41,33.74 C16.1 31.84,33.58 U9.5 | v36.79,33.83 36.82,33.86 C27.1 39.61,33.86 U12.5 | U8.5 34.58,38.3 C12.1 33.08,38.38 v33.02,38.33 | R17.2 R18.2 30,30.16 v30.04,30.19 | v29.21,26.9 29.21,27.05 C24.1 31.5,28.11 U13.5 | v55.12,29.19 55.12,28.55 C25.1 56.03,27.93 U14.5 | U11.5 49.83,41.8 C20.1 v48.57,43.01 | U15.5 54.47,40.05 C23.1 | TP_5V.1 79.15,78.32 5V.2
  Top 0.508: U25.3 145.29,18.81 C32.2 | C32.2 C31.2 | TP_5V.1 84.69,78.39 88.21,78.39 v88.27,78.33 | C13.1 52.38,36.92 v52.41,36.9 | C2.1 A2.3 128.47,30.51 129.96,29.02 U17.3 132.22,19.76 C9.1 | v54.42,38.81 54.42,40.04 C23.1 | C32.2 146.61,18.51 v146.61,17.07 | U40.4 44.68,43.53 46.64,45.49 46.64,46.97 v48.67,49
  Bottom 0.508: J6.5 4.49,50.35 1.16,47.03 1.16,16.12 10.26,7.02 17.7,7.02 22.47,2.25 43.18,2.25 | 43.18,2.25 67.76,2.25 71.44,5.92 78.28,5.92 86.31,13.95 86.46,13.95 86.61,14.09 108.44,14.09 | v20.23,34.02 20.99,33.26 20.99,27.68 v20.97,27.66 21.26,27.37 27.66,27.37 29.18,25.85 | v30.09,35.06 29.4,34.36 29.4,30.83 v30.04,30.19 30.04,27.73 v29.21,26.9 29.21,25.85 29.18,25.85 | v33.02,38.33 34.29,37.06 34.29,36.33 v36.79,33.83 43.97,33.83 46.92,30.88 v47.65,30.88 v47.66,30.87 47.66,13.78 | v55.81,35.29 54.61,34.09 52.78,34.09 | 52.78,34.09 51.97,33.28 v51.97,31.34 52.6,30.71 53.59,30.71 v55.12,29.19 55.12,21.26 54.61,20.75 54.61,20.73 | 52.51,36.9 v54.42,38.81 50.23,43.01 v48.57,43.01 48.67,43.11 v48.67,49 48.67,58.63 52.5,62.46 67.31,62.46 83.19,78.33 v88.27,78.33 | 52.51,36.9 v52.41,36.9 | 52.78,34.09 52.51,34.36 52.51,36.9 | A2.3 128.47,26.39 124.84,22.76 117.11,22.76 108.44,14.09 | A1.VIN 175.58,24.68 165.99,15.09 145.82,15.09 | v146.61,17.07 146.61,15.88 145.82,15.09 | v64.27,30.97 64.27,30.39 54.61,20.73 | 145.82,15.09 144.82,14.09 108.44,14.09 | 43.18,2.25 43.73,2.8 43.73,9.75 43.73,9.85 | 43.73,9.85 43.73,11.3 29.18,25.85 | 54.61,20.73 47.66,13.78 | 47.66,13.78 43.73,9.85
+12V  (via drill 0.35, 0.76)
  Top 0.152: 12V.2 79.09,81.93 TP_12V.1 86.39,80.19 v86.79,80.19
  Top 0.254: R73.1 R74.1 16.76,27.5 16.76,29.44 14.4,31.8 v13.97,31.8
  Top 0.508: 1.65,15.61 8.2,15.61 9.97,17.38 C8.1 9.72,20.16 9.72,21.68 9.15,22.25 U18.5 | J1.1 163.62,18.54 158.92,13.84 84.83,13.84 80.11,9.12 v80.01,9.12 76.88,9.12 69.44,1.68 31.96,1.68 26.59,7.04 8.48,7.04 1.65,13.88 1.65,15.61 | 1.65,15.61 1.65,32.77 | 1.65,32.77 1.65,54.22 3.78,56.35 J6.7 | J2.1 123.18,102.22 v91.44,102.22 | U1.4 97.49,83.33 99.72,85.55 99.72,88.93 | R56.2 99.72,88.93 | 1.65,32.77 2.52,33.64 v4.29,33.64 | 99.72,88.93 99.72,92.21 98.04,93.89 97.55,93.89 U16.4 95.25,96.19 v95.25,98.02 | A2.1 123.39,34.32 122.03,35.68 C1.1 114.75,35.68 XF1.3 XF1.4 106.79,35.66 D9.3
  Bottom 0.254: 7.44,33.64 10.41,30.67 U2.5 | 9.13,27.14 9.98,26.29 U2.1 U2.2 10.35,26.73 9.54,26.73 | v13.97,31.8 12.01,31.8 11.98,31.77
  Bottom 0.508: C3.1 11.98,31.77 10.12,33.64 7.44,33.64 v4.29,33.64 4.93,32.99 4.93,31.98 | U3.8 8.64,23.09 6.3,25.43 C6.1 C7.1 6.3,28.07 4.93,29.44 | R3.2 4.93,29.44 | 4.93,29.44 4.93,31.98 | 9.54,26.73 9.13,27.14 8.88,27.4 8.88,29.18 7.34,30.71 6.21,30.71 4.93,31.98 | v95.25,98.02 95.25,98.25 91.44,102.06 v91.44,102.22 91.37,102.22 87.53,98.38 87.53,80.9 88.04,80.39 | v80.01,9.12 77.47,6.58 71.12,6.58 68.76,4.22 46.72,4.22 J3.5 | v80.01,9.12 72.39,16.74 72.39,56.11 89.36,73.08 89.36,79.07 88.04,80.39 | v80.01,9.12 102.85,31.96 A2.1 126.51,35.09 128.82,35.09 133.79,30.11 133.79,29.06 133.89,28.97 R39.1 | 88.04,80.39 87.83,80.19 v86.79,80.19
ACCUMULATOR_GND
  Top 0.508: J6.14 20.59,56.35 65.2,100.95 122.75,100.95 131.35,92.34 131.36,92.34 132.76,90.94 132.76,90.93 133.97,89.72 J2.7
AIR2-
  Top 0.152: Q1.3 41.95,71.31 24,53.35 J6.13
AMS_OK  (via drill 0.3)
  Top 0.152: v21.72,54.14 66.78,99.2 96.82,99.2 101.82,94.2 101.82,85.04 U1.3 97.49,78.75 R61.2 92.22,77.66 84.78,85.09 TP_AMS_OK.1 79.14,87 AMS_OK.2
  Bottom 0.152: J5.6 14.69,9.05 16.1,10.46 16.74,10.46 19.46,7.75 26.51,7.75 27.23,8.46 27.23,12.96 30.35,16.08 30.35,22.78 26.54,26.59 20.71,26.59 19.94,27.36 19.94,30.23 16.36,33.81 16.36,48.78 v21.72,54.14
AMS_OK_3.3V
  Top 0.152: R21.1 120.67,85.3 | 120.67,85.3 123.9,85.3 | 123.9,85.3 130.83,85.3 134.62,81.51 134.62,72.8 143.04,64.38 U21.4 | D13.3 123.9,85.3 | R54.1 120.67,85.3
BSPD_CURRENT  (via drill 0.3)
  Top 0.152: J5.10 19.65,13.45 v17.01,16.09 9.62,23.48 7.31,23.48 6.91,23.09 U18.4 6.78,22.12 R11.2 6.6,20.29 D8.3 | v19.09,17.74 18.14,18.7 16.31,18.7 10.77,24.23 10.77,27.74 10.24,28.27 10.24,32.41 41.27,63.45 95.53,63.45 104.14,54.84 104.14,47.78 BSPD_CURRENT.1 111.82,42.64 113.59,40.87 132.82,40.87 136,37.69 136,34.43 139.45,30.98 R44.1
  Bottom 0.152: v19.09,17.74 18.66,17.74 v17.01,16.09
BSPD_CURRENT_TEENSY
  Top 0.152: R45.1 R44.2 144.51,29.83 162.87,29.83 A1.D22
CANH
  Top 0.152: 22.65,12.03 24.59,10.08 29.07,10.08 29.67,9.48 29.67,5.79 32.62,2.84 68.78,2.84 105.33,39.4 126.54,39.4 133.35,32.59 133.35,19.97 135.78,17.54 U25.7 138.72,17.05 149.15,27.48 J1.4 | 22.65,12.03 J5.9 | J6.3 4.08,42.99 4.08,36.64 8.33,32.4 8.33,28.94 10.16,27.11 10.16,23.37 16.81,16.72 17.27,16.72 21.97,12.03 22.65,12.03
CANL
  Top 0.152: J6.2 5.3,41.36 4.39,40.45 4.39,36.77 8.63,32.52 8.63,29.44 10.46,27.61 10.46,24.05 20.32,14.2 23.5,14.2 J5.8 27.31,10.39 29.2,10.39 29.98,9.61 29.98,5.91 32.74,3.15 68.37,3.15 104.93,39.7 126.67,39.7 133.66,32.72 133.66,20.09 134.94,18.81 U25.6 138.36,18.93 140.01,18.93 150.59,29.51 161.59,29.51 J1.3
CHASSIS_GND  (via drill 0.76)
  Top 0.508: v2.86,39.76 2.86,53.41 4.09,54.64 20.81,54.64 65.86,99.68 122.75,99.68 128.47,93.96 128.47,90.15 129.31,89.31 J2.6
  Bottom 0.508: J5.11 14.12,14.59 4.64,14.59 2.86,16.37 v2.86,39.76
CS_LTC_6820
  Top 0.152: U5.5 147.28,59.96 148.02,59.22 148.02,48 A1.D10
CURRENT
  Top 0.152: U18.1 8.21,25.71 7.65,26.27 R9.2 7.63,26.55 7.63,32.67 3.75,36.54 3.75,44.11 5.03,45.39 5.88,45.39 6.48,44.78 6.48,40.33 J6.8 15.62,38.37 41.11,63.86 96.39,63.86 105.41,54.84 105.41,49.76 106.93,48.24 109.25,48.24 CURRENT_SENSE.1 111.1,48.27 113.15,46.21 R64.1
CURRENT_BUFFER
  Top 0.152: U26.2 124.25,45.45 U22.4 U22.3
CURRENT_FILTERED
  Top 0.152: A1.D21 162.12,32.38 159.94,30.2 140.66,30.2 136.3,34.56 136.3,37.82 131.58,42.54 U26.5
CURRENT_REF
  Top 0.152: R66.1 111.76,55.23 109.28,52.75 CURRENT_REF.1 97.34,64.24 41.02,64.24 18.14,41.36 J6.9
CURRENT_REF_BUFFER
  Top 0.152: U27.3 U27.4 124.25,54.6 U28.2
CURRENT_REF_FILTERED
  Top 0.152: U28.5 134.62,49.01 134.62,39.93 136.6,37.95 136.6,34.68 140.78,30.51 157.71,30.51 159.58,32.38 A1.D20
GND  (via drill 0.25, 0.3, 0.3 pad 0.55, 0.35, 0.76)
  Top 0.152: R10.1 3.7,21.66 v3.7,20.81 | U18.2 7.56,25.26 7.31,25.51 v4.12,25.51 | R9.1 v4.12,26.53 | C8.2 12.01,19.37 v12.01,18.4 | U26.3 125.04,44.18 v124.78,44.44 | C30.2 124.8,41.64 v126.05,41.64 | C28.2 123.27,48.1 v124.49,48.1 | U22.2 120.51,45.33 120.08,44.9 v120.08,44.82 | R65.2 117.03,44.74 v115.94,44.74 | C29.2 127.82,49.52 v128.85,49.52 | C45.2 130.13,48.5 v128.97,48.5 | v148.54,20.85 147.32,20.85 C31.1 | C32.1 v148.48,19.32 | C26.1 139.94,22.86 v139.95,22.87 | D4.1 69.03,68.87 v68.95,68.79 | R48.2 65.67,73.2 v65.68,73.21 | Q1.2 64.19,72.9 65.42,74.13 v65.75,74.13 | v36.3,22.19 35.2,22.19 R36.2 | C24.2 28.62,28.26 v27.59,28.26 | U13.2 32.19,25.95 32.19,24.99 v32.32,24.86 | U20.2 v70.97,25.34 | C37.2 71.45,28.02 v71.42,27.99 | U19.3 77.11,23.26 C40.2 74.31,23.26 v74.24,23.19 | C39.2 78.63,28.53 v79.73,28.53 | C43.2 80.14,28.02 v79.73,27.61 | C50.2 70.69,37.34 v70.66,37.37 | U29.2 71.42,34.42 v70.41,34.42 | C51.2 78.37,38.89 v79.5,38.89 | C53.2 80.91,37.97 v79.43,37.97 | C52.2 74.74,30.98 v73.97,30.2 | U30.3 76.59,33.78 v75.23,33.78 | R67.2 116.14,53.71 v116.13,53.72 | U27.2 121.22,54.42 v119.98,54.42 | C48.2 123.47,50.92 v123.44,50.9 | U28.3 126.13,53.57 v124.74,53.57 | C46.2 123.16,57.23 v124.21,57.23 | C49.2 130.15,57.53 v129.08,57.53 | C47.2 127.48,58.45 v129.08,58.45 | v174.42,60 173.23,60 C35.2 | U6.2 v168.05,64.18 v168.05,64.19 | R13.1 173.38,63.25 v174.6,63.25 | R52.2 139.74,73.89 v140.54,74.69 | R46.1 137.31,76.9 v136.56,76.9 | R8.1 112.05,89.97 v112.05,88.92 | U16.2 106.33,94.42 v108.47,94.42 | Q2.2 110.88,87.27 v112.3,87.27 | R54.2 v117.95,79.73 v117.94,79.72 | D13.1 120.45,79.51 v120.47,79.49 | R15.2 92.05,93.88 v92.09,93.84
  Top 0.152: R61.1 98.15,77.7 v99.29,77.7 | C15.1 v149.13,62.34 | R50.2 137.47,54.15 v137.46,54.14 | U5.14 140.93,58.96 v140.24,58.27 | U5.13 140.41,59.46 v139.26,58.31 | v76.43,105.94 75.16,105.94 C33.2 | v45.72,54.59 44.9,53.76 D6.1 | U40.2 34.73,43.16 v32.77,43.16 | C20.2 47,41.86 v47,43.05 | C23.2 52.95,38.77 v52.93,38.75 | C13.2 49.66,36.99 48.48,36.99 v48.47,37 | R16.1 47.82,34.61 v47.81,34.6 | R40.1 v47.35,33.47 | R41.1 46.32,32.09 v47.31,32.09 | C11.2 v57.1,32.66 v57.11,32.66 | U10.2 59.26,31.93 v59.29,31.91 | R22.1 63.76,36.53 v63.69,36.6 | R25.1 62.19,36.51 v62.14,36.55 | R69.2 66.65,32.58 v66.41,32.58 | R63.2 67.19,24.59 v67.12,24.66 | R38.2 60.91,21.66 v60.91,21.63 | U7.2 v24.49,31.26 v24.5,31.25 | C22.2 23.47,29.1 v23.69,28.88 | R33.1 21.34,37.22 v21.34,38.23 | R32.1 23.9,37.16 v24.28,36.78 | R19.1 25.93,33.27 v25.91,33.24 | C16.2 30.54,32.24 v30.21,32.57 | U9.2 33.84,30.2 v33.82,30.18 | C27.2 38.23,31.39 v37.81,30.97 | C12.2 v33.2,36.88 v33.2,36.89 | C25.2 53,28.74 v52.47,29.27 | U14.2 56.81,25.6 v56.81,24.51 | U11.3 51.2,38.32 v51.19,38.31 | U4.2 53.37,31.83 v53.19,31.65 | U8.3 38.29,37.14 v38.73,37.14 | U12.2 40.37,31.56 v40.37,30.39 | U15.3 57.61,37.34 v58.07,37.34 | TP_GND.1 82.12,71 v82.07,71.05 | R72.1 v71.27,91.01 | R7.1 71.22,87.07 v71.2,87.05 | R62.1 97.86,86.92 v97.92,86.87 | C36.2 161.16,64.35 v161.14,64.37 | v166.85,64.42 166.76,64.51 R59.1 | R12.1 164.08,58.19 v165.3,58.19 | v138.2,24.79 138.24,24.83 R45.2 | U25.8 v136.79,16.27 v136.78,16.26 | U25.2 145.07,17.54 v145.09,17.55 | R1.1 71.17,78.41 v71.14,78.39 | D10.1 v169.09,52.3 | D14.1 v169.14,50.73 | R77.1 50.83,22.68 v50.77,22.73 | R78.1 v38.18,26.09 | R55.1 32.03,15.01 v31.98,14.96
  Top 0.152: R82.1 17.41,34.2 v17.4,34.22 | R79.1 v39.24,39.22 | R80.1 v56.16,43 | R81.1 v43.31,28.55 | R87.1 29.32,36.32 v28.04,36.32 | R86.1 45.36,36.65 v45.39,36.63 | R85.1 v62.13,40.21 | R84.1 v64.64,38.3 | R2.1 v70.99,74.65 | R71.1 v71.25,82.02 | C14.2 141.72,63.46 v141.99,63.73 | U21.3 156.8,65.34 v156.97,65.51 | J1.2 159.24,22.86 v158.75,23.34 | J3.8 35.96,5.93 v35.05,6.83 | D5.1 143.26,78.4 v143.26,77.19 | D12.1 33.86,10.47 v33.78,10.39 | D8.1 4.32,19.37 v4.32,19.53 | D9.1 104.46,33 v103.89,33 | D7.1 41.22,10.21 v41.15,10.14
  Top 0.508: C1.2 118.97,34.18 v117.8,33.01 | C2.2 132.4,29.1 v132.38,29.08 | v103.68,22.4 103.68,23.06 D1.1 | v131.29,16.13 132.38,17.22 C9.2 | C10.2 124.64,17.53 v124.59,17.48 | U17.1 124.98,19.38 v122.99,19.38
  Bottom 0.152: C4.2 v5.15,16.88 | v15.82,15.23 15.28,15.77 R60.1 | U3.1 14.8,23.8 v14.8,24.37 | v15.69,28.56 15.69,27.73 15.26,27.29 U2.8 | U2.4 9.86,27.79 9.54,28.11 v9.54,29.93 | v6.55,29.7 6.55,29.31 C7.2 | v9.34,24.75 8.95,24.75 C6.2 | C3.2 14.54,30.49 13.79,29.74 v13.79,29.6 | R43.2 v134.66,30.49 | R30.2 v135.59,44.24 v135.58,44.24 | C5.2 4.43,17.55 v4.01,17.55 | D16.1 17.68,18.81 v17.68,17.78 | R89.2 24.13,20.54 v24.13,19.28 | Q3.2 28.51,20.92 v28.68,20.75 | R91.2 20,23.91 v20.42,23.5 | Q4.2 26.25,25.36 v26.39,25.22 | D15.1 18.85,27.2 v19.05,27.41
  other vias: 43.48,124.87 43.64,113.67 43.64,105.11 43.71,96.62 42.98,89.13 36.68,82.09 29.01,74.47 21.08,70.28 149.86,73.89 152.4,71.35 156.21,70.08 161.29,70.08 166.37,70.08 182.19,61.95 182.32,55.93 182.55,49.43 182.42,42.95 182.42,36.81 182.19,30.89 182.32,24.51
  pour GND: -24.13,148.82 -24.13,-6.12 196.85,-6.12 196.85,151.36 -24.13,151.36
  pour Top: 17.98,73.28 23.65,73.28 40.72,90.35 40.72,126.87 46.56,126.87 46.56,87.43 26.14,67.01 18.06,67.01 17.98,66.93
  pour Bottom: 40.39,126.87 46.53,126.87 46.56,126.85 46.56,87.43 26.14,67.01 17.98,67.01 17.98,73.28 23.62,73.28 40.69,90.35 40.69,126.57
  pour Top (isolate 0.305): 170.67,73.13 170.67,67.03 151.41,67.03 144.4,74.04 149.64,79.29 155.8,73.13
  pour Bottom (isolate 0.305): 149.63,79.27 155.78,73.13 170.7,73.13 170.7,67.03 151.41,67.03 144.4,74.04
  pour Top (isolate 0.305): 185.45,65.56 178.23,65.56 178.23,19.86 185.45,19.86
  pour Bottom (isolate 0.305): 185.45,65.56 185.45,19.84 178.23,19.84 178.23,65.56
HV+_OUT_OK
  Top 0.152: U8.4 43.12,38.3 | U11.1 48.67,38.3 43.18,38.3 43.12,38.3 | 43.12,38.3 R79.2
IM  (via drill 0.35)
  Top 0.152: U5.10 136.23,60.96 v135.8,61.4 | v82.55,104.37 74.93,104.37 71.45,107.85 T1.10
  Bottom 0.152: v135.8,61.4 135.37,61.4 92.4,104.37 v82.55,104.37
IMD_OK  (via drill 0.3)
  Top 0.152: v23.21,54 23.21,54.46 67.62,98.87 86.95,98.87 | 86.95,98.87 89.37,98.87 92.72,95.51 | IMD_OK.2 79.16,90.96 TP_IMD_OK.1 85.09,91.39 85.09,97 86.95,98.87 | R14.1 92.72,95.51 | R62.2 97.52,89.56 U16.3 95.8,91.38 95.25,91.92 95.25,92.98 92.72,95.51 | J5.7 31,12.05 31.18,11.87 32.23,11.87 34.04,13.68 D12.3
  Bottom 0.152: v23.21,54 23.01,54 16.66,47.65 16.66,33.94 20.24,30.35 20.24,27.48 20.84,26.89 26.67,26.89 30.68,22.88 30.68,14.08 J5.7
IMD_OK_TEENSY  (via drill 0.3)
  Top 0.152: R14.2 88.77,93.91 R15.1 88.81,92.69 v88.75,92.64
  Bottom 0.152: v88.75,92.64 89.08,92.97 101.62,92.97 134.2,60.39 134.2,36.21 140.66,29.75 148.77,29.75 150.18,31.16 A1.D16
IP  (via drill 0.35)
  Top 0.152: U5.11 142.03,60.43 135.3,60.43 v134.54,61.19 | v84.84,103.61 78.1,110.34 T1.12
  Bottom 0.152: v134.54,61.19 92.12,103.61 v84.84,103.61
ISO_PACK+
  Top 0.152: R29.1 58.43,22.19 45.01,8.77 J3.1
ISO_PACK-
  Top 0.152: R77.2 55,22.68 R28.1 55.15,20.43 43.18,8.47 J3.2
ISO_TS+
  Top 0.152: R27.1 33.51,21.65 39.93,15.23 J3.3
ISO_TS-
  Top 0.152: R26.1 32.03,20.81 | J3.4 39.61,10.69 39.61,14.97 33.78,20.8 32.04,20.8 32.03,20.81 | R55.2 32.03,20.81
MHS
  Top 0.152: J2.3 137.18,88.22 138.64,88.22 139.24,87.62 139.24,80.49 | 139.24,80.49 139.24,78.83 R46.2 139.95,77.79 139.95,76.35 R51.1 | D5.3 141.07,80.49 139.24,80.49
MHS_TEENSY  (via drill 0.3)
  Top 0.152: R51.2 138.49,72.69 R52.1 139.69,71.52 v139.69,71.35
  Bottom 0.152: v139.69,71.35 139.54,71.2 139.54,70.92 138.45,69.83 138.45,46.89 139.09,46.25 139.09,32.59 141.33,30.35 143.69,30.35 145.1,31.77 A1.D14
N$1
  Top 0.152: 3.3V.1 77.37,74.65 R2.2
N$2
  Top 0.152: 5V.1 R1.2
N$3
  Bottom 0.152: U3.6 7.17,20.31 6.9,20.03 C5.1 | R6.1 6.33,20.31 U3.6 | U3.2 11.31,21.58 10.65,20.91 10.64,20.91 10.03,20.31 U3.6
N$4
  Top 0.152: R31.1 45.05,49.65 45.05,51.67 D6.2
N$5
  Bottom 0.152: C4.1 8.64,17.71 U3.5
N$6
  Bottom 0.152: R3.1 R6.2 6.76,21.58 U3.7
N$7
  Top 0.152: R49.2 64.37,70.19 Q1.1
N$8
  Top 0.152: R34.2 106.4,91.95 U16.1
N$9
  Top 0.152: D11.1 R8.2
N$10
  Top 0.152: U13.1 31.56,24.72 32.2,24.08 R27.2 33.53,24.06 R36.1
N$11
  Top 0.152: U13.3 32.86,26.47 32.59,26.74 31.27,26.74 30.99,26.46 30.99,24.62 R26.2 28.94,24.08 R35.1
N$12
  Top 0.152: U18.3 6.28,23.82 R11.1 R10.2
N$13
  Top 0.152: A1.D11 146.05,48.57 146.05,49.76 | 146.05,49.76 R92.1 | U5.2 146.39,58.34 146.81,58.34 147.32,57.84 147.32,51.03 146.05,49.76
N$14
  Top 0.152: 12V.1 74.19,81.96 R71.2
N$15
  Top 0.152: U6.1 171.18,62.74 R13.2 169.15,65.76 159.92,65.76 157.96,63.8 156.87,63.8 U21.2
N$16
  Top 0.152: R56.1 102.84,83.06 105.18,80.71 U1.1
N$17
  Top 0.152: AMS_OK.1 74.11,87.08 R7.2
N$18  (via drill 0.35)
  Top 0.152: v16.12,23.87 16.12,24.63 14.61,26.14 TP_TSAL_GREEN.1
  Bottom 0.152: D15.3 17.79,28.16 | U2.9 16.18,26.79 17.79,28.39 17.79,28.16 | 17.79,25.47 R90.1 17.06,24.22 16.7,23.87 v16.12,23.87 | 17.79,25.47 17.79,28.16 | 17.79,25.47 20.97,25.47 R91.1
N$19  (via drill 0.35)
  Top 0.152: v24.38,15.72 TP_TSAL_RED.1
  Bottom 0.152: U3.3 16.02,20.31 D16.3 19.08,20.92 | 19.08,20.92 R88.1 | R89.1 22.04,20.11 21.84,19.91 19.56,19.91 | 19.56,19.91 19.51,19.91 19.08,20.35 19.08,20.92 | 19.56,19.91 23.75,15.72 v24.38,15.72
N$20
  Top 0.152: U1.2 Q2.3
N$22
  Top 0.152: R38.1 R29.2 57.89,23.78 56.65,23.78 56.12,24.31 56.12,25.64 U14.1
N$23
  Top 0.152: R37.1 52.26,24.38 54.93,24.38 55.15,24.6 | R28.2 55.15,24.6 | 55.15,24.6 55.15,26.07 55.74,26.66 56.93,26.66 57.37,26.21 U14.3
N$24
  Top 0.254: R73.2 22.17,23.33 D2.2
N$25
  Top 0.152: U25.4 144.82,21.45 144.82,21.51 148.74,25.43 169.72,25.43 171.63,27.33 171.63,38.87 A1.D4 163.49,47.62 164.48,48.61 170.91,48.61 171.9,47.62 A1.D0
N$26
  Top 0.152: C39.1 76.62,26.42 U19.1 79.36,25.86 81.59,23.62 82.08,23.62 U19.6
N$27
  Top 0.152: IMD_OK.1 77.36,91.01 R72.2
N$29
  Top 0.152: U25.1 144.07,16.89 145.36,16.89 145.74,17.28 145.74,17.82 145.36,18.21 144.12,18.21 144.11,18.2 142.77,18.2 142.64,18.33 142.64,19.28 142.77,19.42 144.06,19.42 145.12,20.48 145.12,21.38 145.26,21.52 146.35,21.52 146.48,21.38 146.48,20.44 146.76,20.16 148.75,20.16 153.71,25.12 169.85,25.12 171.98,27.26 171.98,41.06 | A1.D1 171.98,46.14 171.98,41.06 | A1.D3 171.98,41.06
N$30
  Top 0.152: Q2.1 113.13,85.37 R21.2
N$36
  Top 0.152: U5.16 139.37,55.27 R47.1
N$37
  Top 0.152: U5.15 141.4,58.46 139.9,56.97 R47.2 R50.1
N$39
  Top 0.152: C33.1 74.6,107.52 73.34,108.78 T1.11
N$41
  Top 0.152: U11.4 51.22,41.75 R57.1
N$43
  Top 0.152: A1.D12 143.51,48.57 R70.1 145.14,51.81 145.14,58.58 145.53,58.96 U5.3
N$44
  Top 0.152: A1.D13 141.15,33.79 141.15,49.12 143.1,51.07 143.88,51.07 144.53,51.72 144.53,58.4 145.59,59.46 U5.4
N$45
  Top 0.152: U19.8 82.39,27.33 C43.1
N$46
  Top 0.254: R74.2 18.29,23.33 D3.2
N$47
  Top 0.152: R75.1 D10.2
N$48
  Top 0.152: R63.1 R58.2 70.08,26 U20.1
N$49
  Top 0.152: R57.2 46.73,44.31 44.19,41.77 39.41,41.77 U40.1
N$50
  Top 0.152: U26.6 128.92,44.18 127.04,46.06 127.03,46.06 U26.1 126.37,48.45 C29.1
N$51
  Top 0.152: C45.1 132.14,47.28 U26.8
N$52
  Top 0.152: R64.2 120.3,46.21 | U22.1 121.03,46.21 120.3,46.21 | R65.1 120.3,46.21
N$53
  Top 0.152: C47.1 126.37,57.72 U28.1 127.03,55.2 127.04,55.2 128.92,53.33 U28.6
N$54
  Top 0.152: C49.1 132.26,56.55 U28.8
N$55
  Top 0.152: R66.2 119.02,55.12 119.4,55.12 | 119.4,55.12 U27.1 | R67.1 118.9,54.63 119.4,55.12
N$56
  Top 0.152: C51.1 76.87,37.77 U30.1 78.23,36.04 80.77,33.5 U30.6
N$57
  Top 0.152: C53.1 82.08,37.64 U30.8
N$58
  Top 0.152: R69.1 R68.2 69.42,35.17 U29.1
N$59
  Top 0.152: R76.1 D14.2
N$60
  Bottom 0.152: R88.2 20.79,21.2 21.41,21.82 24.57,21.82 Q3.1
N$61
  Bottom 0.152: R90.2 18.76,23.36 19.28,22.84 22.61,22.84 23.19,23.42 Q4.1
OKHS
  Top 0.152: J2.2 133.97,90.41 135,89.38 135,86.77 134.4,86.16 131.78,86.16 123.45,94.49 D11.2 111.2,93.65 R34.1
PACK+_BUFFER
  Top 0.152: U29.3 U29.4 74.62,34.77 U30.2
PACK+_FILTERED  (via drill 0.25)
  Top 0.152: v85.09,31.98 82.33,31.98 U30.5
  Bottom 0.152: v85.09,31.98 93.98,31.98 103.02,41.02 128.83,41.02 140.41,29.44 151.31,29.44 152.72,30.85 A1.D17
PACK+_OUT
  Top 0.152: R42.2 42.42,30.23 48.26,30.23 | 48.26,30.23 52.48,30.23 | 52.48,30.23 52.73,30.23 | 55.03,30.23 U14.4 | U4.3 54.02,31.52 52.73,30.23 | 55.03,30.23 55.82,30.23 | U10.1 55.82,30.23 | R37.2 52.48,30.23 | 52.73,30.23 55.03,30.23 | 55.82,30.23 64.57,30.23 64.97,30.63 64.97,32.42 R68.1 67.7,37.94 PACK+_OUT_TEST.1 | 48.26,30.23 46.58,28.55 R81.2
PRECHARGE+_OUT_OK
  Top 0.152: U11.2 50.6,39.58 50.6,40.1 51.66,41.16 | 51.66,41.16 55.98,41.16 U15.4 | 51.66,41.16 53.2,42.71 R80.2
PRECHARGE_OK  (via drill 0.25, 0.3 pad 0.55, 0.35)
  Top 0.152: U40.3 43.41,46.3 R31.2 46.5,58.41 49.16,61.07 v49.16,62.35 | v67.51,68.81 67.37,68.96 R49.1 R48.1 67.47,71.74 67.96,72.24 D4.3 79.42,72.24 83.75,67.91 112.13,67.91 115.57,71.35 123.19,71.35 134.62,59.92 134.62,49.76 v136.65,47.73 | v49.99,21.66 49.99,17.59 46.08,13.68 D7.3 42.16,9.77 41.15,8.75 41.15,6.83 40.24,5.93 J3.7
  Bottom 0.152: v67.51,68.81 54.23,68.81 49.16,63.73 | 49.16,63.73 v49.16,62.35 | v49.99,21.66 49.99,37.61 47.78,39.83 47.78,62.35 49.16,63.73 | v136.65,47.73 136.71,47.67 R23.1
PRECHARGE_OK_TEENSY
  Bottom 0.152: R23.2 138.41,44.26 R30.1 138.43,44.2 138.43,32.41 140.79,30.05 146.23,30.05 147.64,31.46 A1.D15
PRECHARGE_REACHED
  Top 0.152: U12.4 39.37,35.4 | 39.37,35.4 36.81,35.4 36.61,35.6 U8.2 | 39.37,35.4 40.62,36.65 R86.2
SHDN
  Bottom 0.508: 1.82,40.67 1.82,16.42 10.51,7.73 17.98,7.73 | 17.98,7.73 22.73,2.98 41.37,2.98 42.47,4.08 J3.6 | J5.5 17.98,7.73 | 1.82,40.67 3.9,42.75 6.31,42.75 7.93,44.36 J6.10 | J6.12 6.95,48.85 4.56,48.85 1.82,46.12 1.82,40.67
TD+
  Top 0.152: TP6.1 82.83,129.66 J4.1 82.83,126.99 80.47,124.63 T1.1 73.23,126.63 R53.2
TD-
  Top 0.152: T1.3 71.45,127.65 72.14,128.33 R53.1 76.1,131.79 TP7.1 79.84,129.71 J4.2
TEENSY_OK
  Top 0.152: R76.2 161.69,49.36 161.69,46.73 161.18,46.22 158.79,46.22 157.8,47.21 A1.D6 160.04,49.86 160.04,54.16 162.25,56.37 162.25,61.78 C36.1 164.79,62.85 R59.2 167.04,62.81 U6.3
TIMER_EN
  Bottom 0.152: U2.10 14.62,25.45 15.44,24.63 15.44,21.89 14.52,20.97 13.12,20.97 12.7,20.55 12.7,19.28 12.94,19.04 U3.4 13.85,17.66 R60.2
TS+_OUT
  Top 0.152: U7.1 24.86,29 33.53,29 | 33.53,29 32.86,28.33 U13.4 31.85,27.15 | 33.53,29 37.11,29 U12.1 | 33.53,29 34.49,29.95 U9.3 | R35.2 28.22,23.09 28.22,24.64 30.74,27.15 31.85,27.15 | 31.85,27.15 36.44,27.15 | 36.44,27.15 64.47,27.15 | 64.47,27.15 67.22,27.15 R58.1 | TS+_OUT_TEST.1 64.47,27.15 | R78.2 36.44,27.15
TS+_OUT_BUFFER
  Top 0.152: U20.3 U20.4 77.07,24.7 U19.2
TS+_OUT_FILTERED  (via drill 0.25)
  Top 0.152: v85.09,21.82 82.61,21.82 U19.5
  Bottom 0.152: v85.09,21.82 103.95,40.68 128.69,40.68 140.25,29.11 153.92,29.11 155.26,30.45 A1.D18
TS+_OUT_OV_OK
  Top 0.152: U8.1 34.49,34.63 34.49,34.52 | 34.49,34.52 U9.4 | 34.49,34.52 32.66,36.35 R87.2
TSAL_GREEN  (via drill 0.35)
  Top 0.254: v25.15,23.34 25.15,22.58 24.89,22.33 23.18,22.33 D2.1
  Bottom 0.152: J5.3 24.13,10.53 24.13,13.44 29.72,19.03 29.72,22.07 28.45,23.34 v25.15,23.34
  Bottom 0.254: Q4.3 24.14,23.34 v25.15,23.34
TSAL_RED  (via drill 0.35)
  Top 0.254: D3.1 23.11,18.51 v25.15,18.51
  Bottom 0.152: v25.15,18.51 25.15,15.56 24.66,15.07 22.71,15.07 21.08,13.44 21.08,9.88 20.25,9.05 J5.4
  Bottom 0.254: v25.15,18.51 25.55,18.91 Q3.3
V_PACK_REF_OV_OK
  Top 0.152: U4.4 54.02,36.08 U15.1 55.8,38.6 56.24,39.04 57.95,39.04 R85.2
V_PACK_REF_UV_OK
  Top 0.152: U15.2 56.45,37.25 56.99,36.71 58.44,36.71 | U10.4 58.44,36.71 | 58.44,36.71 60.03,38.3 R84.2
WATCHDOG_INPUT
  Top 0.152: 165.35,59.93 R12.2 162.55,58.43 162.55,56.22 160.35,54.02 160.35,49.74 | A1.D5 160.34,49.73 160.35,49.74 | 160.35,49.74 162.91,52.3 R75.2 | 165.35,59.93 173.33,51.95 WATCHDOG_OK.1 | 165.35,59.93 166.9,59.93 U6.4

## Text on the board
tPlace: HyTech Racing 2022 / Accumulator Control Unit Rev2 / Designed by Joshua Kirshenbaum